# EAGLE design cutdown (EAGLE 9.2.1)
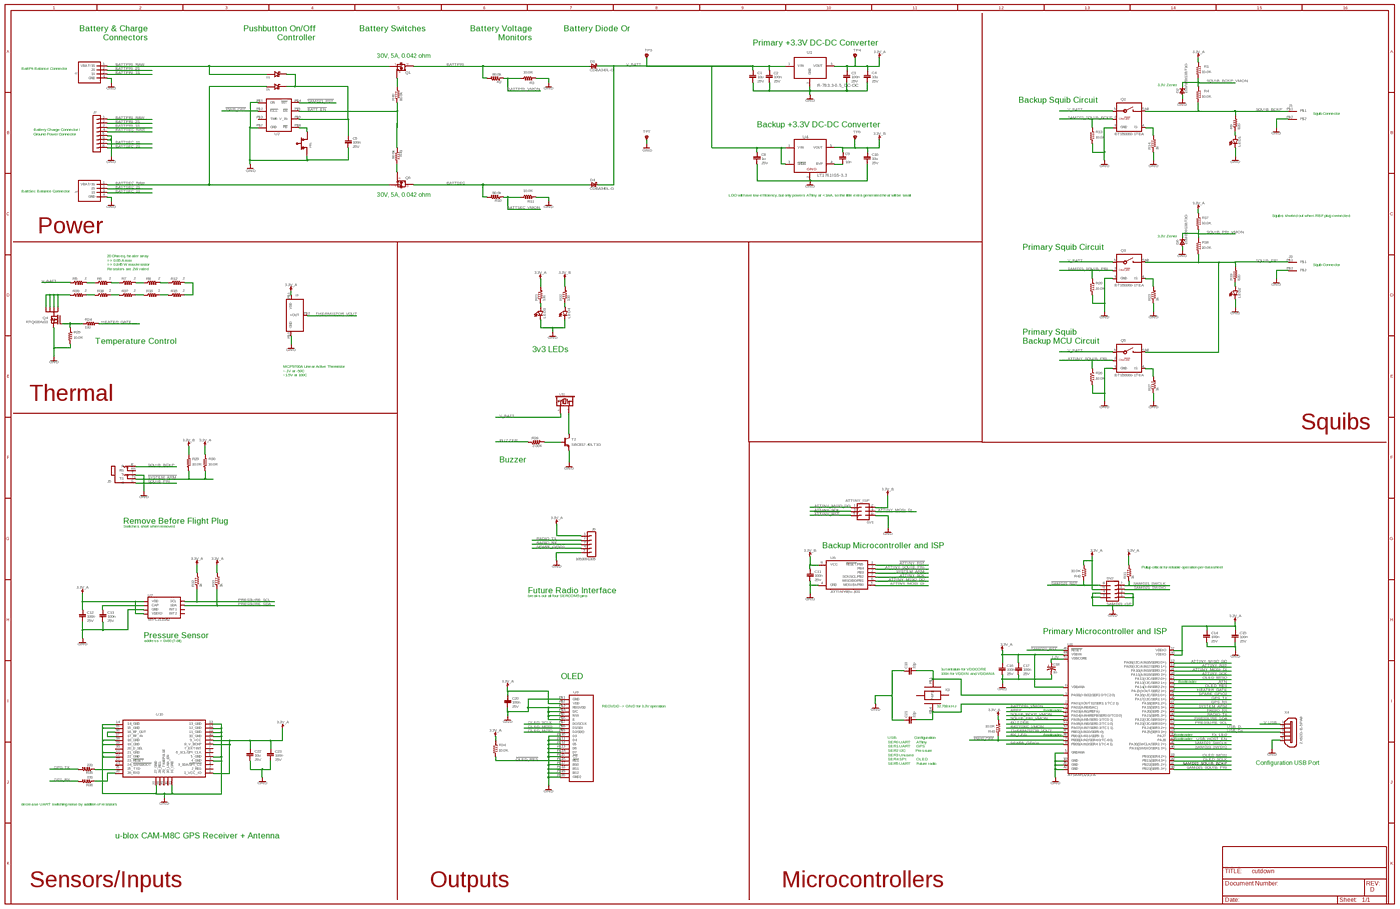
[diagram p0: schematic, sheet 1, overview]
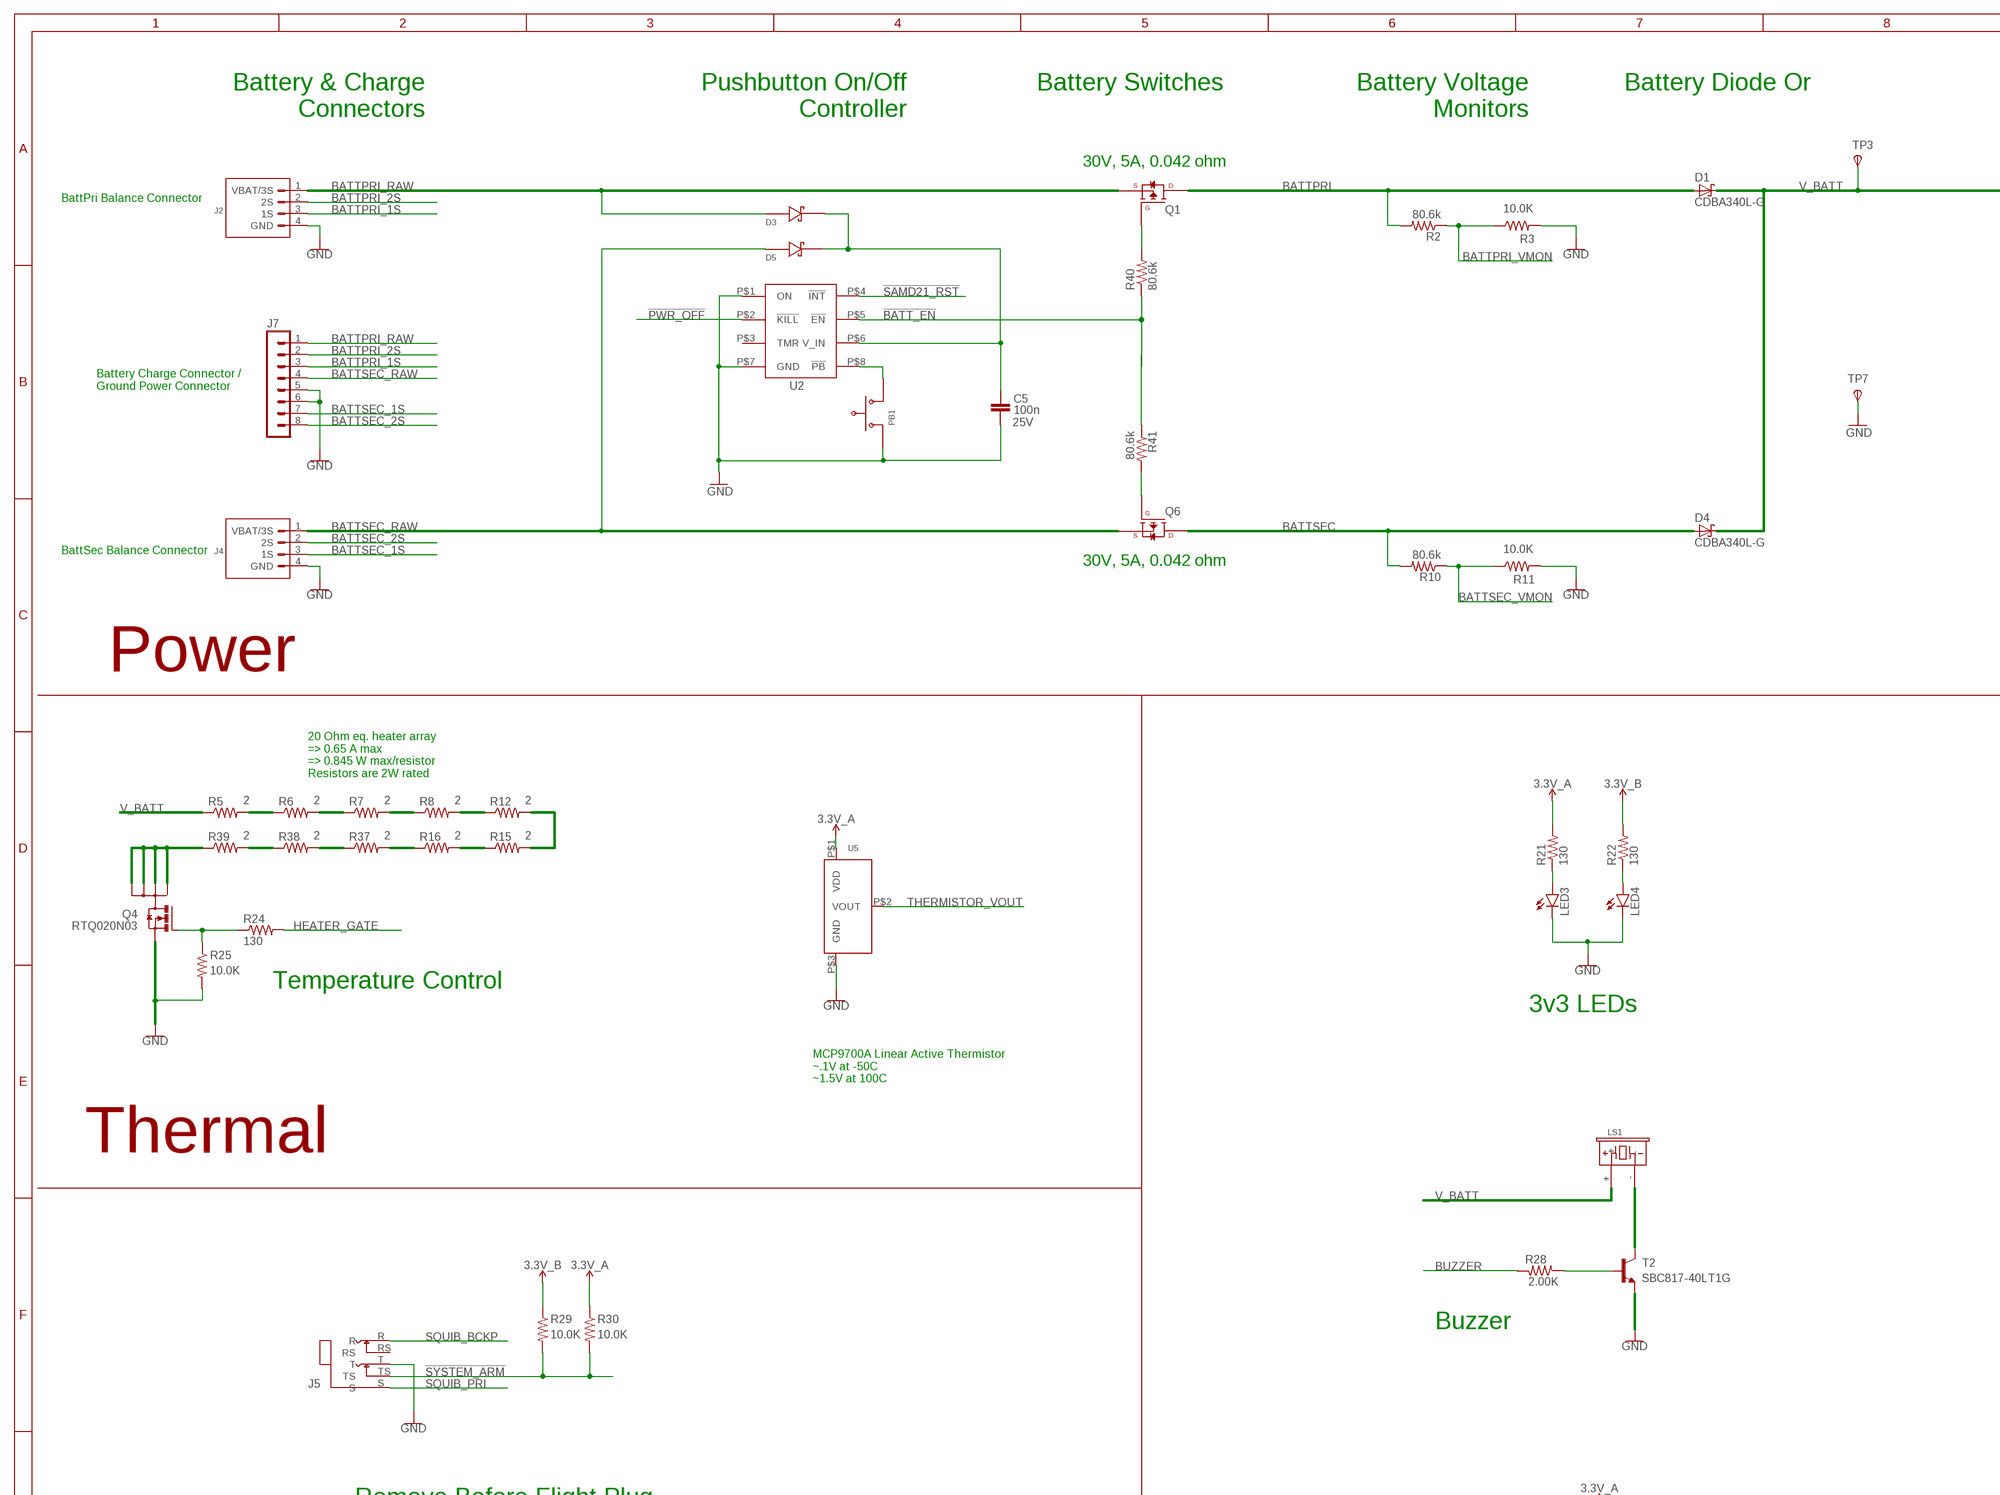
[diagram p1: schematic, sheet 1, part 1 of 4]
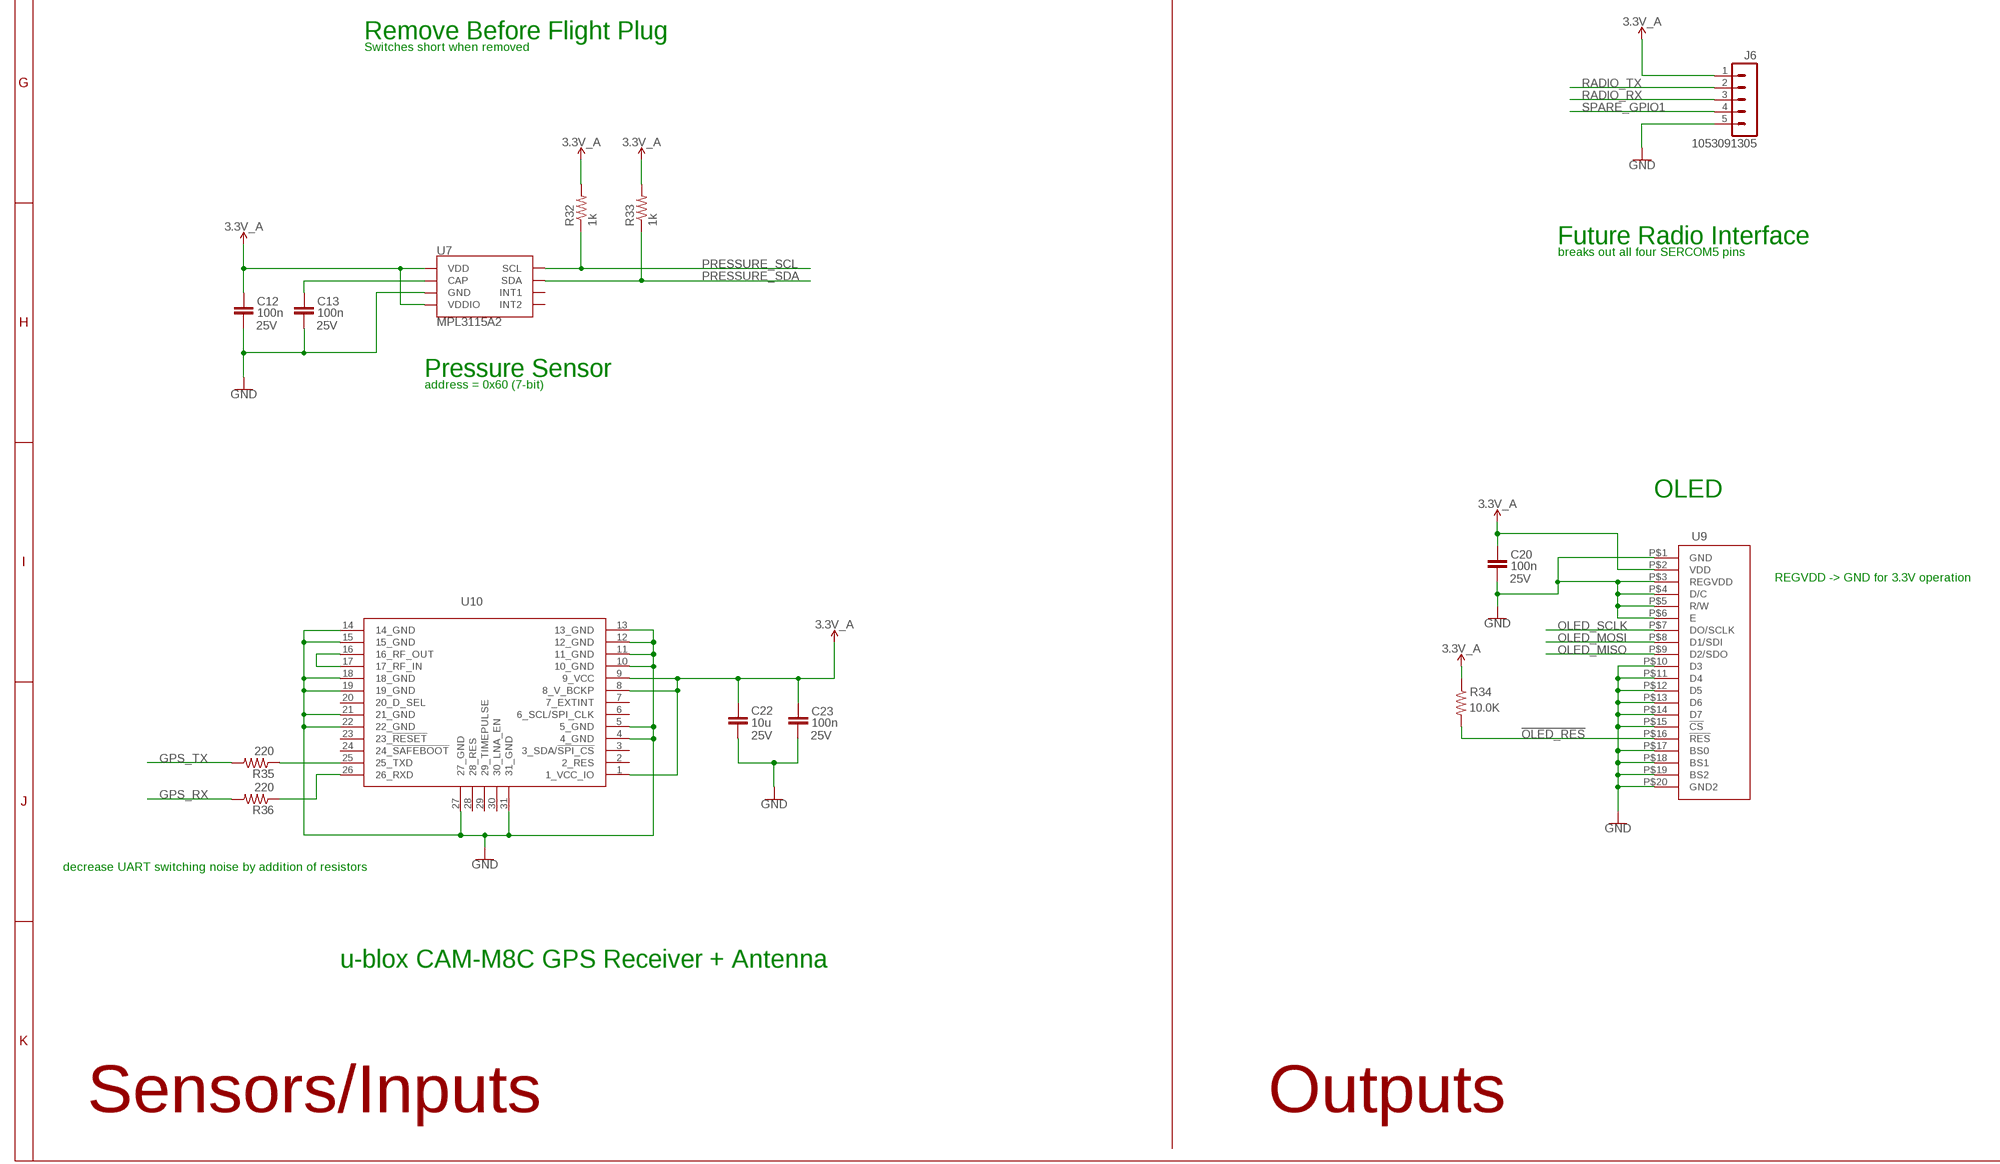
[diagram p2: schematic, sheet 1, part 2 of 4]
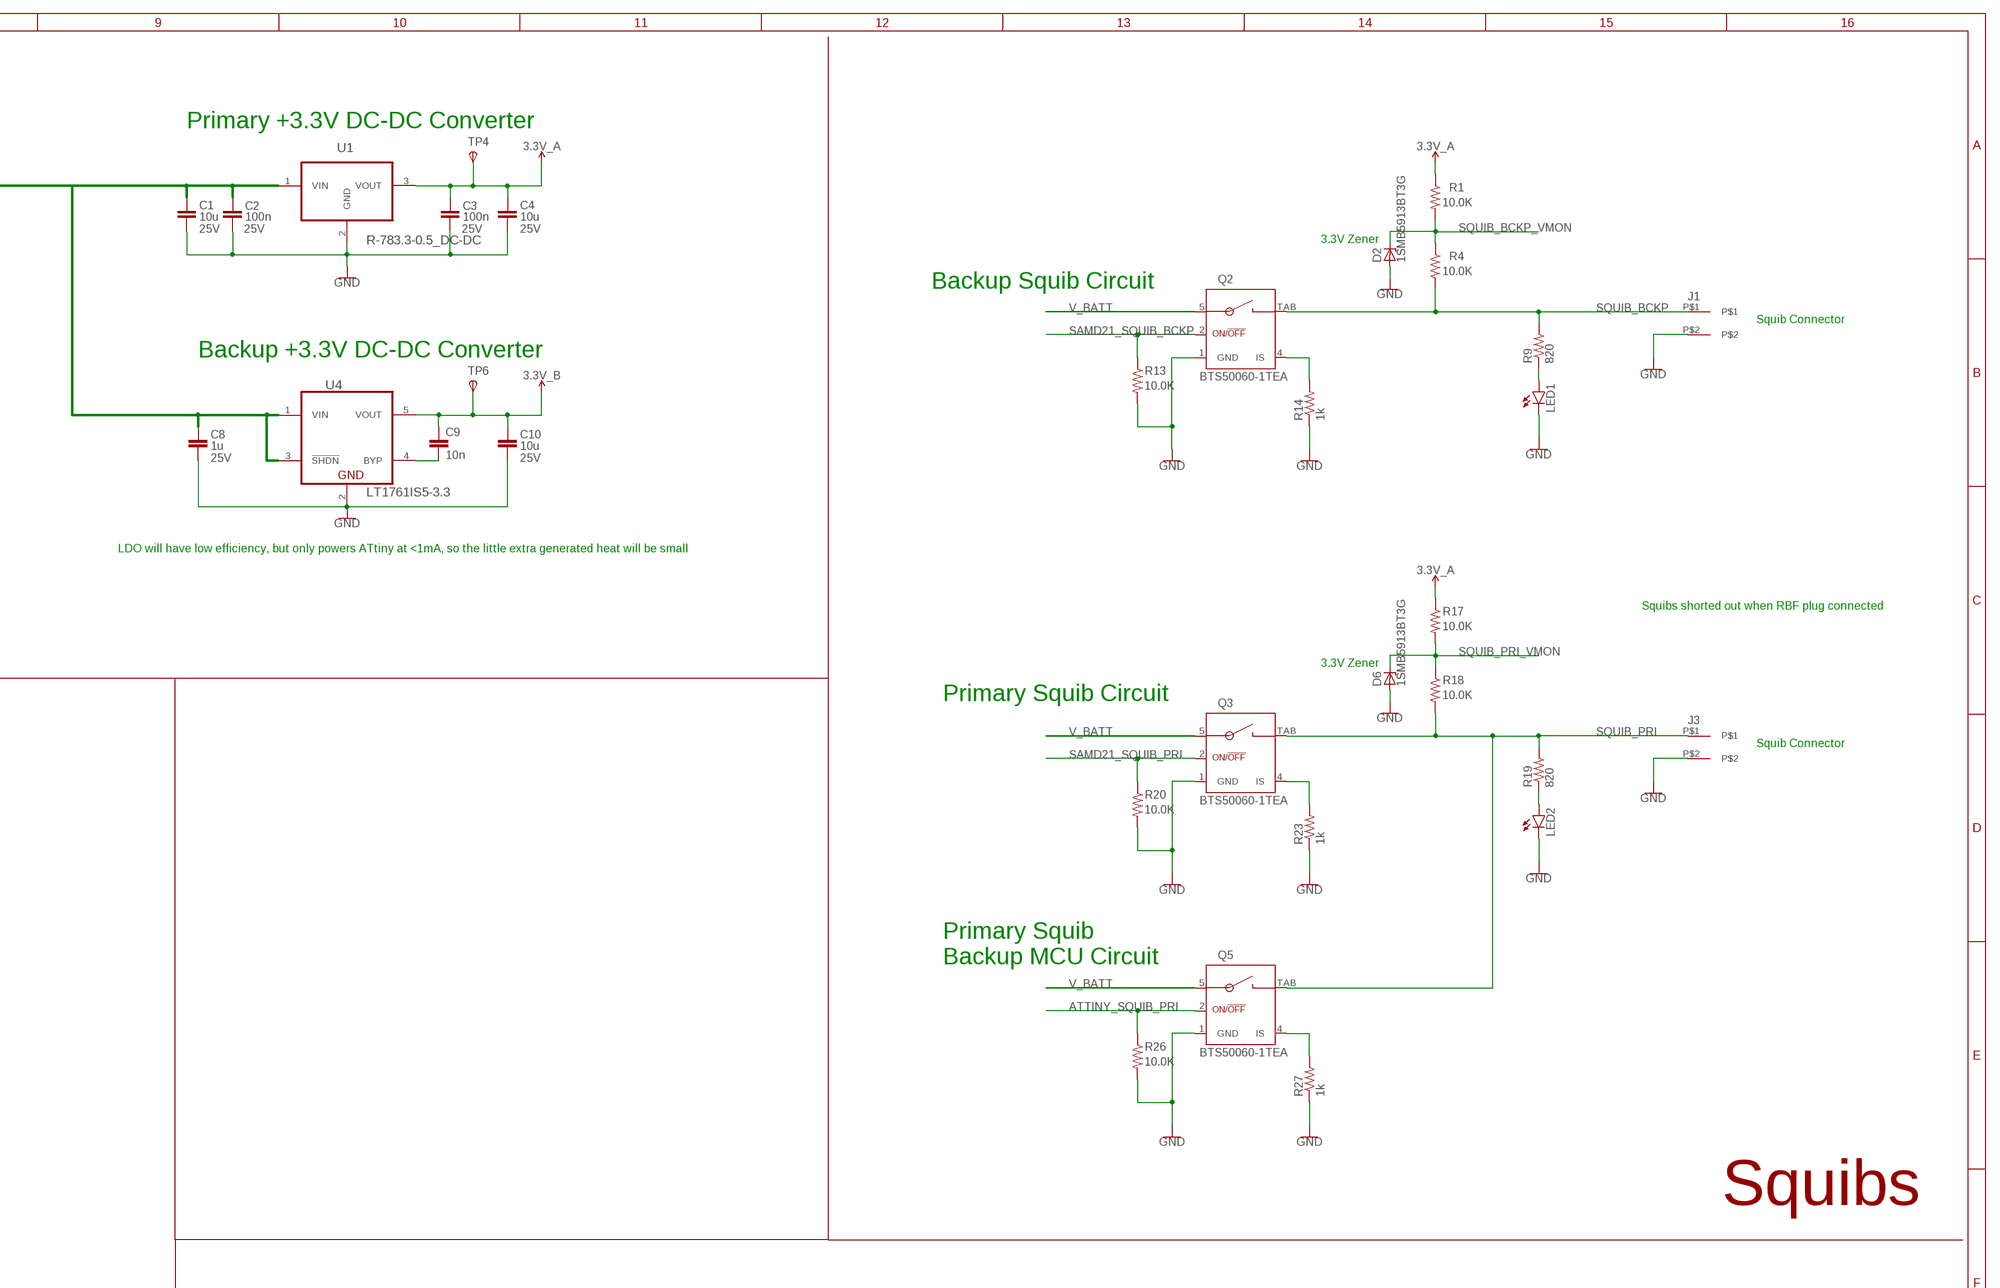
[diagram p3: schematic, sheet 1, part 3 of 4]
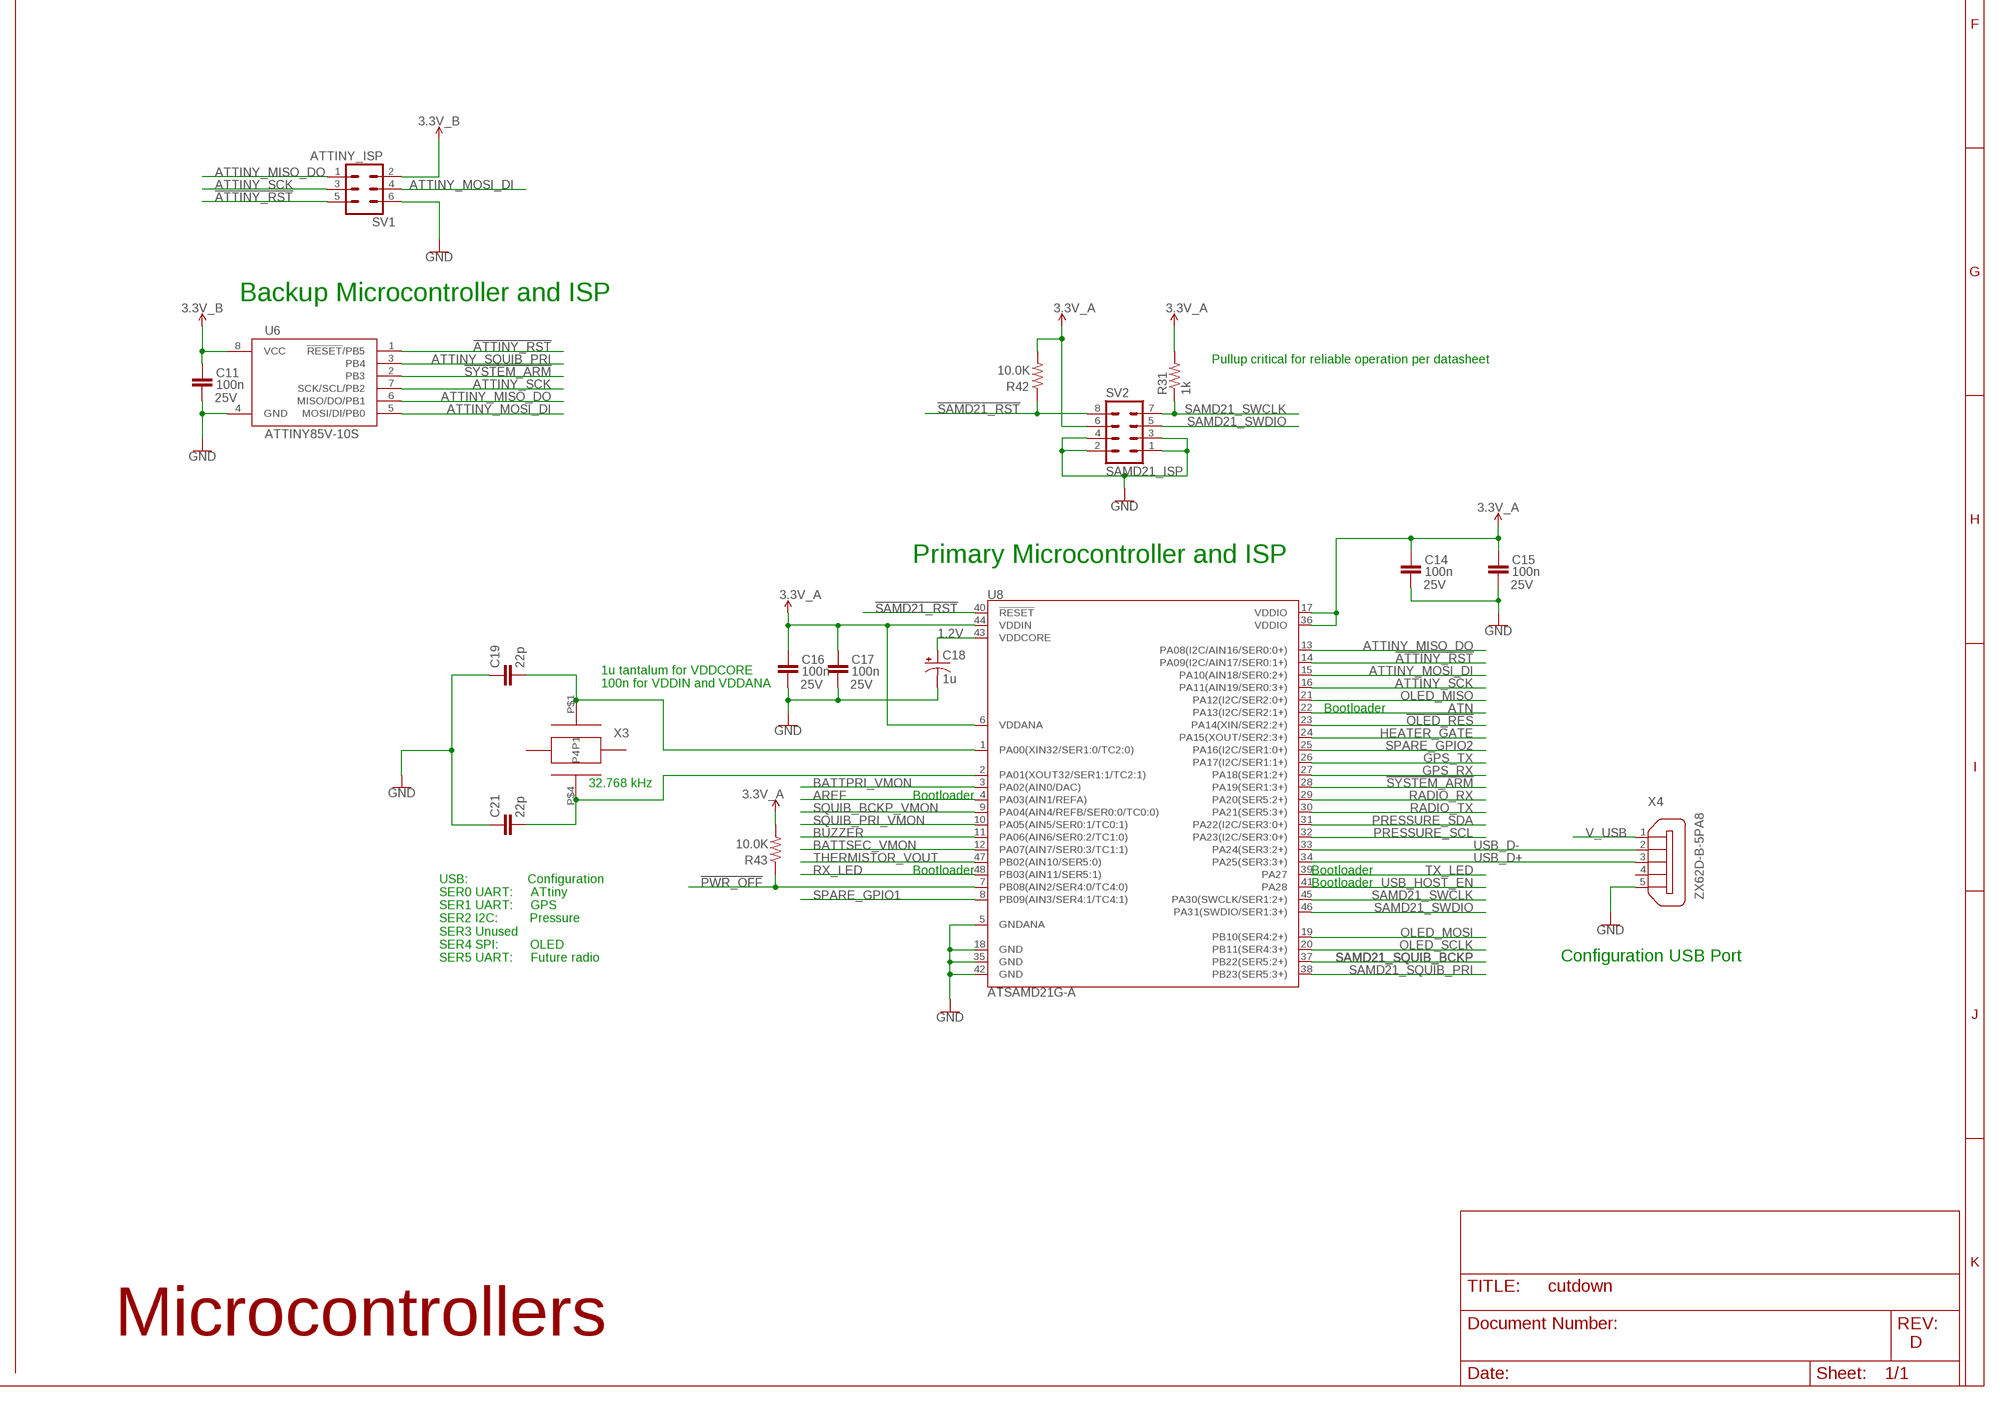
[diagram p4: schematic, sheet 1, part 4 of 4]

## Parts
C1  10u  C-EUC1206  [C1206]
C2  100n  C-EUC0805  [C0805]
C3  100n  C-EUC0805  [C0805]
C4  10u  C-EUC1206  [C1206]
C5  100n  C-EUC0805  [C0805]
C8  1u  C-EUC1206  [C1206]
C9  10n  C-EUC0805  [C0805]
C10  10u  C-EUC1206  [C1206]
C11  100n  C-EUC0805  [C0805]
C12  100n  C-EUC0805  [C0805]
C13  100n  C-EUC0805  [C0805]
C14  100n  C-EUC0805  [C0805]
C15  100n  C-EUC0805  [C0805]
C16  100n  C-EUC0805  [C0805]
C17  100n  C-EUC0805  [C0805]
C18  1u  CPOL-USCT3216  [CT3216]
C19  22p  C-EUC0805  [C0805]
C20  100n  C-EUC0805  [C0805]
C21  22p  C-EUC0805  [C0805]
C22  10u  C-EUC1206  [C1206]
C23  100n  C-EUC0805  [C0805]
D1  CDBA340L-G  [DO214AC]
D2  1SMB5913BT3G  [DO214AA]
D3  BAT54HT1G  [BAT54HT1G]
D4  CDBA340L-G  [DO214AC]
D5  BAT54HT1G  [BAT54HT1G]
D6  1SMB5913BT3G  [DO214AA]
J1  DECTOR_PARTS_TR_NANOFIT_1X2_RA  [DECTOR_PARTS_TR_NANOFIT_1X2_RIGHTANGLE]
J2  S4B-XH-SM4-TB-3S-BALANCE  [S4B-XH-SM4-TB]
J3  DECTOR_PARTS_TR_NANOFIT_1X2_RA  [DECTOR_PARTS_TR_NANOFIT_1X2_RIGHTANGLE]
J4  S4B-XH-SM4-TB-3S-BALANCE  [S4B-XH-SM4-TB]
J5  RN114BPC  [RN114BPC]
J6  1053091305  [1053091305]
J7  1053141208  [1053141208]
LED1  LEDCHIP-LED0805  [CHIP-LED0805]
LED2  LEDCHIP-LED0805  [CHIP-LED0805]
LED3  LEDCHIP-LED0805  [CHIP-LED0805]
LED4  LEDCHIP-LED0805  [CHIP-LED0805]
LS1  CEM-1212C  [CEM-1212C]
PB1  FP11SPA1B1TP03  [FP11SPA1B1TP03]
Q1  SI2347DS-T1-GE3  [SI1247DS]
Q2  BTS50060-1TEA  [PG-TO252-5-11]
Q3  BTS50060-1TEA  [PG-TO252-5-11]
Q4  RTQ020N03  [SC-95(TSMT6)]
Q5  BTS50060-1TEA  [PG-TO252-5-11]
Q6  SI2347DS-T1-GE3  [SI1247DS]
R1  10.0K  R-US_R0805  [R0805]
R2  80.6k  R-US_R0805  [R0805]
R3  10.0K  R-US_R0805  [R0805]
R4  10.0K  R-US_R0805  [R0805]
R5  2  R-US_R2512  [R2512]
R6  2  R-US_R2512  [R2512]
R7  2  R-US_R2512  [R2512]
R8  2  R-US_R2512  [R2512]
R9  820  R-US_R0805  [R0805]
R10  80.6k  R-US_R0805  [R0805]
R11  10.0K  R-US_R0805  [R0805]
R12  2  R-US_R2512  [R2512]
R13  10.0K  R-US_R0805  [R0805]
R14  1k  R-US_R0805  [R0805]
R15  2  R-US_R2512  [R2512]
R16  2  R-US_R2512  [R2512]
R17  10.0K  R-US_R0805  [R0805]
R18  10.0K  R-US_R0805  [R0805]
R19  820  R-US_R0805  [R0805]
R20  10.0K  R-US_R0805  [R0805]
R21  130  R-US_R0805  [R0805]
R22  130  R-US_R0805  [R0805]
R23  1k  R-US_R0805  [R0805]
R24  130  R-US_R0805  [R0805]
R25  10.0K  R-US_R0805  [R0805]
R26  10.0K  R-US_R0805  [R0805]
R27  1k  R-US_R0805  [R0805]
R28  2.00K  R-US_R0805  [R0805]
R29  10.0K  R-US_R0805  [R0805]
R30  10.0K  R-US_R0805  [R0805]
R31  1k  R-US_R0805  [R0805]
R32  1k  R-US_R0805  [R0805]
R33  1k  R-US_R0805  [R0805]
R34  10.0K  R-US_R0805  [R0805]
R35  220  R-US_R0805  [R0805]
R36  220  R-US_R0805  [R0805]
R37  2  R-US_R2512  [R2512]
R38  2  R-US_R2512  [R2512]
R39  2  R-US_R2512  [R2512]
R40  80.6k  R-US_R0805  [R0805]
R41  80.6k  R-US_R0805  [R0805]
R42  10.0K  R-US_R0805  [R0805]
R43  10.0K  R-US_R0805  [R0805]
SV1  ATTINY_ISP  MA03-2  [MA03-2]
SV2  SAMD21_ISP  MA04-2  [MA04-2]
T2  SBC817-40LT1G  BC846  [SOT23]
TP3  TPSPAD1-13  [P1-13]
TP4  TPSPAD1-13  [P1-13]
TP6  TPSPAD1-13  [P1-13]
TP7  TPSPAD1-13  [P1-13]
U1  R-783.3-0.5_DC-DC  [R-783P3-0P5_DC-DC]
U2  LTC2955ITS8-2  [LTC2955_TSOT-8]
U4  LT1761IS5-3.3  [TSOT23-5]
U5  MCP9700T-E/TT  [MCP9700T-E/TT]
U6  ATTINY85V-10S  [SOIC8_EIAJ_208MIL]
U7  MPL3115A2  [LGA-8-5X3]
U8  ATSAMD21G-A  [TQFP-48]
U9  NHD-0216CW-AW3  [NHD-0216CW-AW3]
U10  CAM-M8C-0  [CAM_M8C]
X3  MC-146-32.7680KA-A0  [MC-146]
X4  ZX62D-B-5PA8  [ZX62D-B-5PA8]

## Nets
1.2V: C18.+ U8.43(VDDCORE)
!ATTINY_RST!: SV1.5 U6.1(!RESET!/PB5) U8.14(PA09(I2C/AIN17/SER0:1+))
!BATT_EN: R40.1 R41.1 U2.P$5(!EN)
!OLED_RES!: R34.2 U8.23(PA14(XIN/SER2:2+)) U9.P$16(!RES!)
!PWR_OFF!: R43.1 U2.P$2(!KILL) U8.7(PB08(AIN2/SER4:0/TC4:0))
!SAMD21_RST!: R42.1 SV2.8 U2.P$4(!INT) U8.40(!RESET!)
!SYSTEM_ARM!: J5.TS R29.2 R30.2 U6.2(PB3) U8.28(PA19(SER1:3+))
AREF: U8.4(PA03(AIN1/REFA))
ATN: U8.22(PA13(I2C/SER2:1+))
ATTINY_MISO_DO: SV1.1 U6.6(MISO/DO/PB1) U8.13(PA08(I2C/AIN16/SER0:0+))
ATTINY_MOSI_DI: SV1.4 U6.5(MOSI/DI/PB0) U8.15(PA10(AIN18/SER0:2+))
ATTINY_SCK: SV1.3 U6.7(SCK/SCL/PB2) U8.16(PA11(AIN19/SER0:3+))
ATTINY_SQUIB_PRI: Q5.2(IN) R26.1 U6.3(PB4)
BATTPRI: D1.A Q1.D R2.2
BATTPRI_1S: J2.3(1S) J7.3
BATTPRI_2S: J2.2(2S) J7.2
BATTPRI_RAW: D3.A J2.1(VBAT/3S) J7.1 Q1.S
BATTPRI_VMON: R2.1 R3.1 U8.3(PA02(AIN0/DAC))
BATTSEC: D4.A Q6.D R10.2
BATTSEC_1S: J4.3(1S) J7.7
BATTSEC_2S: J4.2(2S) J7.8
BATTSEC_RAW: D5.A J4.1(VBAT/3S) J7.4 Q6.S
BATTSEC_VMON: R10.1 R11.1 U8.12(PA07(AIN7/SER0:3/TC1:1))
BUZZER: R28.2 U8.11(PA06(AIN6/SER0:2/TC1:0))
GND: C1.2 C2.2 C3.2 C4.2 C5.2 C8.2 C10.2 C11.2 C12.2 C13.2 C14.2 C15.2 C16.2 C17.2 C18.- C19.1 C20.2 C21.1 C22.2 C23.2 D2.A D6.A J1.P$2 J2.4(GND) J3.P$2 J4.4(GND) J5.T J6.5 J7.5 J7.6 LED1.C LED2.C LED3.C LED4.C PB1.1 Q2.1(GND) Q3.1(GND) Q4.4(S) Q5.1(GND) R3.2 R11.2 R13.2 R14.1 R20.2 R23.1 R25.2 R26.2 R27.1 SV1.6 SV2.1 SV2.2 SV2.3 SV2.4 T2.2(E) TP7.TP(PP) U1.2(GND) U2.P$1(ON) U2.P$7(GND) U4.2(GND) U5.P$3(GND) U6.4(GND) U7.3(GND) U8.5(GNDANA) U8.18(GND) U8.35(GND) U8.42(GND) U9.P$1(GND) U9.P$3(REGVDD) U9.P$4(D/C) U9.P$5(R/W) U9.P$6(E) U9.P$10(D3) U9.P$11(D4) U9.P$12(D5) U9.P$13(D6) U9.P$14(D7) U9.P$15(!CS!) U9.P$17(BS0) U9.P$18(BS1) U9.P$19(BS2) U9.P$20(GND2) U10.4(4_GND) U10.5(5_GND) U10.10(10_GND) U10.11(11_GND) U10.12(12_GND) U10.13(13_GND) U10.14(14_GND) U10.15(15_GND) U10.18(18_GND) U10.19(19_GND) U10.21(21_GND) U10.22(22_GND) U10.27(27_GND) U10.31(31_GND) X4.5
GPS_RX: R36.2 U8.27(PA18(SER1:2+))
GPS_TX: R35.2 U8.26(PA17(I2C/SER1:1+))
HEATER_GATE: R24.2 U8.24(PA15(XOUT/SER2:3+))
N$2: R28.1 T2.1(B)
N$3: R5.2 R6.1
N$4: Q1.G R40.2
N$5: R6.2 R7.1
N$6: R7.2 R8.1
N$7: R8.2 R12.1
N$8: R12.2 R15.2
N$9: C13.1 U7.2(CAP)
N$10: U10.16(16_RF_OUT) U10.17(17_RF_IN)
N$11: R35.1 U10.25(25_TXD)
N$12: C21.2 U8.2(PA01(XOUT32/SER1:1/TC2:1)) X3.P$4(P4)
N$13: LED3.A R21.1
N$14: Q2.4(IS) R14.2
N$15: LED4.A R22.1
N$16: LED1.A R9.1
N$17: R15.1 R16.2
N$18: R16.1 R37.2
N$19: Q3.4(IS) R23.2
N$20: Q5.4(IS) R27.2
N$21: LED2.A R19.1
N$22: R37.1 R38.2
N$23: Q4.3(G) R24.1 R25.1
N$24: C19.2 U8.1(PA00(XIN32/SER1:0/TC2:0)) X3.P$1(P1)
N$25: R38.1 R39.2
N$26: LS1.- T2.3(C)
N$27: C9.2 U4.4(BYP)
N$28: R36.1 U10.26(26_RXD)
N$29: Q4.1(D) Q4.2(D) Q4.5(D) Q4.6(D6) R39.1
N$30: Q6.G R41.2
N$32: PB1.3 U2.P$8(!PB)
N$33: C5.1 D3.C D5.C U2.P$6(V_IN)
OLED_MISO: U8.21(PA12(I2C/SER2:0+)) U9.P$9(D2/SDO)
OLED_MOSI: U8.19(PB10(SER4:2+)) U9.P$8(D1/SDI)
OLED_SCLK: U8.20(PB11(SER4:3+)) U9.P$7(DO/SCLK)
PRESSURE_SCL: R32.1 U7.8(SCL) U8.32(PA23(I2C/SER3:0+))
PRESSURE_SDA: R33.1 U7.7(SDA) U8.31(PA22(I2C/SER3:0+))
RADIO_RX: J6.3 U8.29(PA20(SER5:2+))
RADIO_TX: J6.2 U8.30(PA21(SER5:3+))
RX_LED: U8.48(PB03(AIN11/SER5:1))
SAMD21_SQUIB_BCKP: Q2.2(IN) R13.1 U8.37(PB22(SER5:2+))
SAMD21_SQUIB_PRI: Q3.2(IN) R20.1 U8.38(PB23(SER5:3+))
SAMD21_SWCLK: R31.1 SV2.7 U8.45(PA30(SWCLK/SER1:2+))
SAMD21_SWDIO: SV2.5 U8.46(PA31(SWDIO/SER1:3+))
SPARE_GPIO1: J6.4 U8.8(PB09(AIN3/SER4:1/TC4:1))
SPARE_GPIO2: U8.25(PA16(I2C/SER1:0+))
SQUIB_BCKP: J1.P$1 J5.R Q2.TAB(OUT) R4.2 R9.2
SQUIB_BCKP_VMON: D2.C R1.2 R4.1 U8.9(PA04(AIN4/REFB/SER0:0/TC0:0))
SQUIB_PRI: J3.P$1 J5.S Q3.TAB(OUT) Q5.TAB(OUT) R18.2 R19.2
SQUIB_PRI_VMON: D6.C R17.2 R18.1 U8.10(PA05(AIN5/SER0:1/TC0:1))
THERMISTOR_VOUT: U5.P$2(VOUT) U8.47(PB02(AIN10/SER5:0))
TX_LED: U8.39(PA27)
USB_D+: U8.34(PA25(SER3:3+)) X4.3
USB_D-: U8.33(PA24(SER3:2+)) X4.2
USB_HOST_EN: U8.41(PA28)
V_BATT: C1.1 C2.1 C8.1 D1.C D4.C LS1.+ Q2.5(VS) Q3.5(VS) Q5.5(VS) R5.1 TP3.TP(PP) U1.1(VIN) U4.1(VIN) U4.3(!SHDN)
V_USB: X4.1
VCC_1: C3.1 C4.1 C12.1 C14.1 C15.1 C16.1 C17.1 C20.1 C22.1 C23.1 J6.1 R1.1 R17.1 R21.2 R30.1 R31.2 R32.2 R33.2 R34.1 R42.2 R43.2 SV2.6 TP4.TP(PP) U1.3(VOUT) U5.P$1(VDD) U7.1(VDD) U7.4(VDDIO) U8.6(VDDANA) U8.17(VDDIO) U8.36(VDDIO) U8.44(VDDIN) U9.P$2(VDD) U10.1(1_VCC_IO) U10.8(8_V_BCKP) U10.9(9_VCC) ; supply symbol labelled 3.3V_A
VCC_2: C9.1 C10.1 C11.1 R22.2 R29.1 SV1.2 TP6.TP(PP) U4.5(VOUT) U6.8(VCC) ; supply symbol labelled 3.3V_B
Unconnected: J5.RS U2.P$3(TMR) U7.5(INT2) U7.6(INT1) U10.2(2_RES) U10.3(3_SDA/!SPI_CS!) U10.6(6_SCL/SPI_CLK) U10.7(7_EXTINT) U10.20(20_D_SEL) U10.23(23_!RESET!) U10.24(24_!SAFEBOOT!) U10.28(28_RES) U10.29(29_TIMEPULSE) U10.30(30_LNA_EN) X3.P$2 X3.P$3 X4.4 X4.S1 X4.S2 X4.S3 X4.S4

## Notes on the sheet
- Battery & Charge
  Connectors
- Pushbutton On/Off
  Controller
- Battery Switches
- Battery Voltage
  Monitors
- Battery Diode Or
- Primary +3.3V DC-DC Converter
- 30V, 5A, 0.042 ohm
- BattPri Balance Connector
- 3.3V Zener
- Backup Squib Circuit
- Squib Connector
- Backup +3.3V DC-DC Converter
- Battery Charge Connector /
  Ground Power Connector
- BattSec Balance Connector
- 30V, 5A, 0.042 ohm | LDO will have low efficiency, but only powers ATtiny at <1mA, so the little extra generated heat will be small
- Squibs shorted out when RBF plug connected
- Power
- 3.3V Zener
- Primary Squib Circuit
- Squib Connector
- 20 Ohm eq. heater array
  => 0.65 A max
  => 0.845 W max/resistor
  Resistors are 2W rated
- Temperature Control
- Primary Squib
  Backup MCU Circuit
- 3v3 LEDs
- MCP9700A Linear Active Thermistor
  ~.1V at -50C
  ~1.5V at 100C
- Thermal
- Squibs
- Buzzer
- Remove Before Flight Plug
- Switches short when removed
- Backup Microcontroller and ISP
- Pullup critical for reliable operation per datasheet
- Future Radio Interface
- breaks out all four SERCOM5 pins
- Primary Microcontroller and ISP
- Pressure Sensor
- address = 0x60 (7-bit)
- 1u tantalum for VDDCORE
  100n for VDDIN and VDDANA
- OLED
- Bootloader
- REGVDD -> GND for 3.3V operation | 32.768 kHz
- Bootloader
- Bootloader | Bootloader
- Bootloader
- USB:                 Configuration
  SER0 UART:     ATtiny
  SER1 UART:     GPS
  SER2 I2C:         Pressure
  SER3 Unused
  SER4 SPI:         OLED
  SER5 UART:     Future radio
- Configuration USB Port
- decrease UART switching noise by addition of resistors
- u-blox CAM-M8C GPS Receiver + Antenna
- Sensors/Inputs | Outputs | Microcontrollers
- D

## Library data of the parts
C1 C4 C10 C22 = rcl:C-EU: CAPACITOR, European symbol; MFG: Samsung; MFG_DESCRIPTION: CAP CER 10UF 25V X7R 1206; MFG_PN: CL31B106KAHZW6E; VOLTAGE: 25V
C2 C3 C5 C11-C17 C20 C23 = resistor:C-EU: CAPACITOR, European symbol; MFG: AVX; MFG_DESCRIPTION: 0.10µF ±10% 25V Ceramic Capacitor X7R 0805; MFG_PN: 08053C104KAT2A; VOLTAGE: 25V
C8 = rcl:C-EU: CAPACITOR, European symbol; MFG: KEMET; MFG_DESCRIPTION: CAP CER 1UF 25V X7R 1206; MFG_PN: C1206C105K3RACTU; VOLTAGE: 25V
C9 = rcl:C-EU: CAPACITOR, European symbol; MFG: Kemet; MFG_DESCRIPTION: CAP CER 10000PF 50V X7R 0805; MFG_PN: C0805C103K5RACTU; SPICEPREFIX: C
C18 = rcl:CPOL-US: POLARIZED CAPACITOR, American symbol; MFG: Kemet; MFG_DESCRIPTION: CAP TANT 1UF 10% 16V 1206; MFG_PN: T491A105K016AT; SPICEPREFIX: C
C19 C21 = rcl:C-EU: CAPACITOR, European symbol; MFG: Kemet; MFG_DESCRIPTION: CAP CER 22PF 50V C0G/NP0 0805; MFG_PN: C0805C220K5GACTU; SPICEPREFIX: C
D1 D4 = Dector_Parts_TR:CDBA340L-G: Diode Schottky 40V 3A Surface Mount DO-214AC; MFG: COMCHIP; MFG_DESCRIPTION: Diode Schottky 40V 3A Surface Mount DO-214AC; MFG_PN: CDBA340L-G
D2 D6 = 1smb59xx_10:1SMB59*BT3G: 1SMB59xxBT3G Series 3 Watt Plastic Surface Mount Zener Voltage Regulators Source: http://www.onsemi.com/pub_link/Collateral/1SMB5913BT3-D.PDF; MF: ON Semiconductor; MFG: ON Semiconductor; MFG_DESCRIPTION: DIODE ZENER 3.3V 3W SMB; MFG_PN: 1SMB5913BT3G; MPN: 1SMB5913BT3G; OC_FARNELL: 1431155; OC_NEWARK: 88H5165
D3 D5 = Dector_Parts_TR:BAT54HT1G; MFG: ON Semiconductor; MFG_DESCRIPTION: DIODE SCHOTTKY 30V 200MA SOD323; MFG_PN: BAT54HT1G
J1 J3 = Solar Cell Carrier Board:DECTOR_PARTS_TR_NANOFIT_1X2_RA: https://www.molex.com/pdm_docs/sd/1053131102_sd.pdf; MFG: Molex; MFG_DESCRIPTION: NANO-FIT RIGHT ANGLE HEADER, TH; MFG_PN: 1053131102
J2 J4 = Dector_Parts_TR:S4B-XH-SM4-TB-3S-BALANCE; MFG: JST Sales America Inc.; MFG_DESCRIPTION: CONN HEADER SMD R/A 4POS 2.5MM; MFG_PN: S4B-XH-SM4-TB(LF)(SN)
J5 = Dector_Parts_TR:RN114BPC; MFG: Switchcraft Inc.; MFG_DESCRIPTION: CONN JACK STEREO 6.35MM R/A; MFG_PN: RN114BPC
J6 = Dector_Parts_TR:1053091305: 5 Pin, 1 Row, Vert PCB; MFG: MOLEX; MFG_DESCRIPTION: NANO-FIT HDR VT SGL KNK 5CKT 30A; MFG_PN: 1053091305
J7 = Dector_Parts_TR:1053141208; MFG: Molex; MFG_DESCRIPTION: CONN HEADER R/A 8POS 2.5MM; MFG_PN: 1053141208
LED1 LED2 = led:LED: LED OSRAM: - CHIPLED LG R971, LG N971, LY N971, LG Q971, LY Q971, LO R971, LY R971 LH N974, LH R974 LS Q976, LO Q976, LY Q976 LO Q996 - Hyper CHIPLED LW Q18S LB Q993, LB Q99A, LB R99A - SideLED LS A670, LO A670, LY A670, LG A670, LP A670 LB A673, LV A673, LT A673, LW A673 LH A674 LY A675 LS A676, LA A676, LO A676, LY A676, LW A676 LS A679, LY A679, LG A679 - Hyper Micro SIDELED® LS Y876, LA Y876, LO Y876, LY Y876 LT Y87S - SmartLED LW L88C, LW L88S LB L89C, LB L89S, LG L890 LS L89K, LO L89K, LY L89K LS L896, LA L896, LO L896, LY L896 - TOPLED LS T670, LO T670, LY T670, LG T670, LP T670 LSG T670, LSP T670, LSY T670, LOP T670, LYG T670 LG T671, LOG T671, LSG T671 LB T673, LV T673, LT T673, LW T673 LH T674 LS T676, LA T676, LO T676, LY T676, LB T676, LH T676, LSB T676, LW T676 LB T67C, LV T67C, LT T67C, LS T67K, LO T67K, LY T67K, LW E67C LS E67B, LA E67B, LO E67B, LY E67B, LB E67C, LV E67C, LT E67C LW T67C LS T679, LY T679, LG T679 LS T770, LO T770, LY T770, LG T770, LP T770 LB T773, LV T773, LT T773, LW T773 LH T774 LS E675, LA E675, LY E675, LS T675 LS T776, LA T776, LO T776, LY T776, LB T776 LHGB T686 LT T68C, LB T68C - Hyper Mini TOPLED® LB M676 - Mini TOPLED Santana® LG M470 LS M47K, LO M47K, LY M47K Source: http://www.osram.convergy.de LUXEON: - LUMILED® LXK2-PW12-R00, LXK2-PW12-S00, LXK2-PW14-U00, LXK2-PW14-V00 LXK2-PM12-R00, LXK2-PM12-S00, LXK2-PM14-U00 LXK2-PE12-Q00, LXK2-PE12-R00, LXK2-PE12-S00, LXK2-PE14-T00, LXK2-PE14-U00 LXK2-PB12-K00, LXK2-PB12-L00, LXK2-PB12-M00, LXK2-PB14-N00, LXK2-PB14-P00, LXK2-PB14-Q00 LXK2-PR12-L00, LXK2-PR12-M00, LXK2-PR14-Q00, LXK2-PR14-R00 LXK2-PD12-Q00, LXK2-PD12-R00, LXK2-PD12-S00 LXK2-PH12-R00, LXK2-PH12-S00 LXK2-PL12-P00, LXK2-PL12-Q00, LXK2-PL12-R00 Source: www.luxeon.com KINGBRIGHT: KA-3528ASYC Source: www.kingbright.com; MFG: Lite-On; MFG_DESCRIPTION: LED RED CLEAR SMD; MFG_PN: LTST-C171KRKT
LED3 LED4 = led:LED: LED OSRAM: - CHIPLED LG R971, LG N971, LY N971, LG Q971, LY Q971, LO R971, LY R971 LH N974, LH R974 LS Q976, LO Q976, LY Q976 LO Q996 - Hyper CHIPLED LW Q18S LB Q993, LB Q99A, LB R99A - SideLED LS A670, LO A670, LY A670, LG A670, LP A670 LB A673, LV A673, LT A673, LW A673 LH A674 LY A675 LS A676, LA A676, LO A676, LY A676, LW A676 LS A679, LY A679, LG A679 - Hyper Micro SIDELED® LS Y876, LA Y876, LO Y876, LY Y876 LT Y87S - SmartLED LW L88C, LW L88S LB L89C, LB L89S, LG L890 LS L89K, LO L89K, LY L89K LS L896, LA L896, LO L896, LY L896 - TOPLED LS T670, LO T670, LY T670, LG T670, LP T670 LSG T670, LSP T670, LSY T670, LOP T670, LYG T670 LG T671, LOG T671, LSG T671 LB T673, LV T673, LT T673, LW T673 LH T674 LS T676, LA T676, LO T676, LY T676, LB T676, LH T676, LSB T676, LW T676 LB T67C, LV T67C, LT T67C, LS T67K, LO T67K, LY T67K, LW E67C LS E67B, LA E67B, LO E67B, LY E67B, LB E67C, LV E67C, LT E67C LW T67C LS T679, LY T679, LG T679 LS T770, LO T770, LY T770, LG T770, LP T770 LB T773, LV T773, LT T773, LW T773 LH T774 LS E675, LA E675, LY E675, LS T675 LS T776, LA T776, LO T776, LY T776, LB T776 LHGB T686 LT T68C, LB T68C - Hyper Mini TOPLED® LB M676 - Mini TOPLED Santana® LG M470 LS M47K, LO M47K, LY M47K Source: http://www.osram.convergy.de LUXEON: - LUMILED® LXK2-PW12-R00, LXK2-PW12-S00, LXK2-PW14-U00, LXK2-PW14-V00 LXK2-PM12-R00, LXK2-PM12-S00, LXK2-PM14-U00 LXK2-PE12-Q00, LXK2-PE12-R00, LXK2-PE12-S00, LXK2-PE14-T00, LXK2-PE14-U00 LXK2-PB12-K00, LXK2-PB12-L00, LXK2-PB12-M00, LXK2-PB14-N00, LXK2-PB14-P00, LXK2-PB14-Q00 LXK2-PR12-L00, LXK2-PR12-M00, LXK2-PR14-Q00, LXK2-PR14-R00 LXK2-PD12-Q00, LXK2-PD12-R00, LXK2-PD12-S00 LXK2-PH12-R00, LXK2-PH12-S00 LXK2-PL12-P00, LXK2-PL12-Q00, LXK2-PL12-R00 Source: www.luxeon.com KINGBRIGHT: KA-3528ASYC Source: www.kingbright.com; MFG: Lite-On; MFG_DESCRIPTION: LED GREEN CLEAR CHIP SMD; MFG_PN: LTST-C171GKT
LS1 = Dector_Parts_TR:CEM-1212C; MFG: CUI Devices; MFG_DESCRIPTION: AUDIO MAGNETIC IND 8-16V TH; MFG_PN: CEM-1212C
PB1 = Dector_Parts_TR:FP11SPA1B1TP03; MFG: C&G; MFG_DESCRIPTION: SWITCH PUSH SPST-NO 0.4VA 28V; MFG_PN: FP11SPA1B1TP03
Q1 Q6 = Dector_Parts_TR:SI2347DS-T1-GE3; MFG: Vishay Siliconix; MFG_DESCRIPTION: MOSFET P-CH 30V 5A SOT-23; MFG_PN: SI2347DS-T1-GE3
Q2 Q3 Q5 = Dector_Parts_TR:BTS50060-1TEA: BTS50060-1TEA 6m ohm High Side Switch D2-Pak (TO-252, 4 pins plus tab); MFG: Infineon; MFG_DESCRIPTION: PWR SW HI-SIDE 1CH TO252-5; MFG_PN: BTS500601TEAAUMA2
Q4 = Dector_Parts_TR:RTQ020N03: MOSFET N-CH 30V 2A TSMT6; MFG: Rohm; MFG_DESCRIPTION: MOSFET N-CH 30V 2A TSMT6; MFG_PN: RTQ020N03TR
R1 R3 R4 R11 R13 R17 R18 R20 R25 R26 R29 R30 R34 R42 R43 = resistor:R-US_: RESISTOR, American symbol; MFG: Panasonic; MFG_DESCRIPTION: RES SMD 10.0K OHM 1% 1/8W 0805; MFG_PN: ERJ-6ENF1002V; PWR: 0.125
R2 R10 R40 R41 = rcl:R-US_: RESISTOR, American symbol; MFG: Panasonic; MFG_DESCRIPTION: RES SMD 80.6K OHM 1% 1/8W 0805; MFG_PN: ERJ-6ENF8062V; PWR: 0.125; SPICEPREFIX: R
R5-R8 R12 R15 R16 R37-R39 = resistor:R-US_: RESISTOR, American symbol; MFG: Bourns Inc.; MFG_DESCRIPTION: RES SMD 2 OHM 5% 2W 2512; MFG_PN: CRM2512-JW-2R0ELF; PWR: 2
R9 R19 = rcl:R-US_: RESISTOR, American symbol; MFG: Panasonic; MFG_DESCRIPTION: RES SMD 820 OHM 1% 1/8W 0805; MFG_PN: ERJ-6ENF8200V; PWR: 0.125; SPICEPREFIX: R
R14 R23 R27 R31-R33 = rcl:R-US_: RESISTOR, American symbol; MFG: Panasonic; MFG_DESCRIPTION: RES SMD 1K OHM 1% 1/8W 0805; MFG_PN: ERJ-6ENF1001V; PWR: 0.125; SPICEPREFIX: R
R21 R22 R24 = rcl:R-US_: RESISTOR, American symbol; MFG: Panasonic; MFG_DESCRIPTION: RES SMD 130 OHM 1% 1/8W 0805; MFG_PN: ERJ-6ENF1300V; PWR: 0.125; SPICEPREFIX: R
R28 = resistor:R-US_: RESISTOR, American symbol; MFG: Panasonic; MFG_DESCRIPTION: RES SMD 2.00K OHM 1% 1/8W 0805; MFG_PN: ERJ-6ENF2001V; PWR: 0.125
R35 R36 = rcl:R-US_: RESISTOR, American symbol; MFG: Panasonic; MFG_DESCRIPTION: RES SMD 220 OHM 1% 1/8W 0805; MFG_PN: ERJ-6ENF2200V; PWR: 0.125; SPICEPREFIX: R
SV1 = con-lstb:MA03-2: PIN HEADER; MFG: Amphenol; MFG_DESCRIPTION: CONN HEADER 6POS .100 STR TIN; MFG_PN: 67996-406HLF; OC_FARNELL: unknown; OC_NEWARK: unknown
SV2 = con-lstb:MA04-2: PIN HEADER; MFG: Amphenol; MFG_DESCRIPTION: CONN HEADER 8POS .100 STR TIN; MFG_PN: 67996-408HLF; OC_FARNELL: unknown; OC_NEWARK: unknown
T2 = transistor-neu-to92:BC846: NPN TRANSISTOR; MFG: On Semi; MFG_DESCRIPTION: TRANS NPN 45V 0.5A SOT-23; MFG_PN: SBC817-40LT1G
TP3 TP4 TP6 = testpad:TPS: TEST PIN
TP7 = testpad:TPS: TEST PIN; MFG: Keystone; MFG_DESCRIPTION: Black PC Test Point, Miniature 0.100 Dia x 0.180 L; MFG_PN: 5001
U1 = Dector_Parts_TR:R-783.3-0.5_DC-DC: RECOM P/N: R-783.3-0.5, DC DC Converter 1 Output 3.3V 500mA 4.75V - 32V Input; MFG: RECOM; MFG_DESCRIPTION: DC DC CONVERTER 3.3V 3W; MFG_PN: R-783.3-0.5
U2 = Dector_Parts_TR:LTC2955ITS8-2; MFG: Linear Technology/Analog Devices; MFG_DESCRIPTION: IC CTLR ON/OFF PUSHBUTT TSOT23-8; MFG_PN: LTC2955ITS8-2#TRMPBF
U4 = Dector_Parts_TR:LT1761IS5-3.3: Linear Voltage Regulator IC Positive Fixed 1 Output 3.3V 100mA TSOT-23-5; MFG: Linear Technology; MFG_DESCRIPTION: IC REG LIN 3.3V 100MA TSOT23-5; MFG_PN: LT1761IS5-3.3#TRMPBF
U5 = Dector_Parts_TR:MCP9700T-E/TT; MFG: Microchip Technology; MFG_DESCRIPTION: SENSOR ANALOG -40C-125C SOT23-3; MFG_PN: MCP9700T-E/TT
U6 = _hhn_attiny25_45_85:ATTINY85*: ATMEL ATtiny 85 Packages: P = PDIP 08 30mil S = SOIC 08 EIAJ 208mil Technologies Note: for complete ordering code (temp. range, finish, tape&reel etc.) see www.atmel.com • Supply Voltage: V = (1.8…5.5)V | [blank] = (2.7…5.5)V • Speed: 10 = 10 MHz | 20 = 20 MHz Author: Dipl.-Ing. FH Rainer Bayer HHN Hochschule Heilbronn (Heilbronn University), rainer.bayer@hs-heilbronn.de Ingenieurbüro ing-rb, mail@ing-rb.de; MFG: Atmel; MFG_DESCRIPTION: IC MCU 8BIT 8KB FLASH 8SOIC; MFG_PN: ATTINY85V-10SU
U7 = SparkFun-Sensors:MPL3115A2: NXP MPL3115A2 Digital Altimeter/Pressure Sensor The MPL3115A2 is a compact piezoresistive absolute pressure sensor with an I2C interface. MPL3115 has a wide operating range of 20kPa to 110 kPa, a range that covers all surface elevations on Earth. The fully internally compensated MEMS in conjunction with an embedded high resolution 24-bit equivalent ADC provide accurate pressure [Pascals] /altitude [meters] and temperature [degrees Celsius] data. Datasheet <http://cdn.sparkfun.com/datasheets/Sensors/Pressure/MPL3115A2.pdf> SparkFun Products SparkFun Altitude/Pressure Sensor Breakout - MPL3115A2 <https://www.sparkfun.com/products/11084> (SEN-11084) SparkFun Weather Shield <https://www.sparkfun.com/products/12081> (DEV-12081) SparkFun Photon Weather Shield <https://www.sparkfun.com/products/13630> (DEV-13630); MFG: NXP; MFG_DESCRIPTION: IC ALTIMETER I2C VERSION 8LGA; MFG_PN: MPL3115A2; PROD_ID: IC-10869
U8 = samd21_lib:ATSAMD21G: Atmel SAMD21G SMART ARM-Based Microcontroller The Atmel ® | SMART ™ SAM D21 is a series of low-power microcontrollers using the 32-bit ARM ® Cortex ® -M0+ processor, and ranging from 32- to 64-pins with up to 256KB Flash and 32KB of SRAM. The SAM D21 devices operate at a maximum frequency of 48MHz and reach 2.46 CoreMark/MHz. They are designed for simple and intuitive migration with identical peripheral modules, hex compatible code, identical linear address map and pin compatible migration paths between all devices in the product series. All devices include intelligent and flexible peripherals, Atmel Event System for inter-peripheral signaling, and support for capacitive touch button, slider and wheel user interfaces.; MFG: Atmel; MFG_DESCRIPTION: IC MCU 32BIT 256KB FLASH 48TQFP; MFG_PN: ATSAMD21G18A-AUT; PROD_ID: IC-13064
U9 = Dector_Parts_TR:NHD-0216CW-AW3: 2x16 Character LCD Display Module 5 x 8 Dots OLED Parallel, 8-Bit, I²C, SPI 76.00mm x 24.50mm x 5.00mm; MFG: Newhaven; MFG_DESCRIPTION: 2X16 WHITE SLIM CHARACTER OLED; MFG_PN: NHD-0216CW-AW3
U10 = Dector_Parts_TR:CAM-M8C-0; MFG: U-Blox America Inc.; MFG_DESCRIPTION: RF RCVR GNSS/GPS 1.575GHZ MODULE; MFG_PN: CAM-M8C-0
X3 = Dector_Parts_TR:MC-146-32.7680KA-A0: CRYSTAL 32.7680 KHZ 12.5PF SMD; MFG: Epson; MFG_DESCRIPTION: CRYSTAL 32.7680 KHZ 12.5PF SMD; MFG_PN: MC-146 32.7680KA-A0:ROHS
X4 = zx62d-b-5pa8-oshpark_10:ZX62D-B-5PA8: Micro USB Type B Connector - Standard, Shell Through Hole Source: http://www.hirose.co.jp/cataloge_hp/ed_ZX_20140804.pdf; MF: Hirose; MFG: Hirose; MFG_DESCRIPTION: CONN RCPT USB MICRO B 2.0 5P SMD; MFG_PN: ZX62D-B-5PA8(30); MPN: ZX62D-B-5PA8; OC_FARNELL: 2300438; OC_NEWARK: 69W0712

## Board
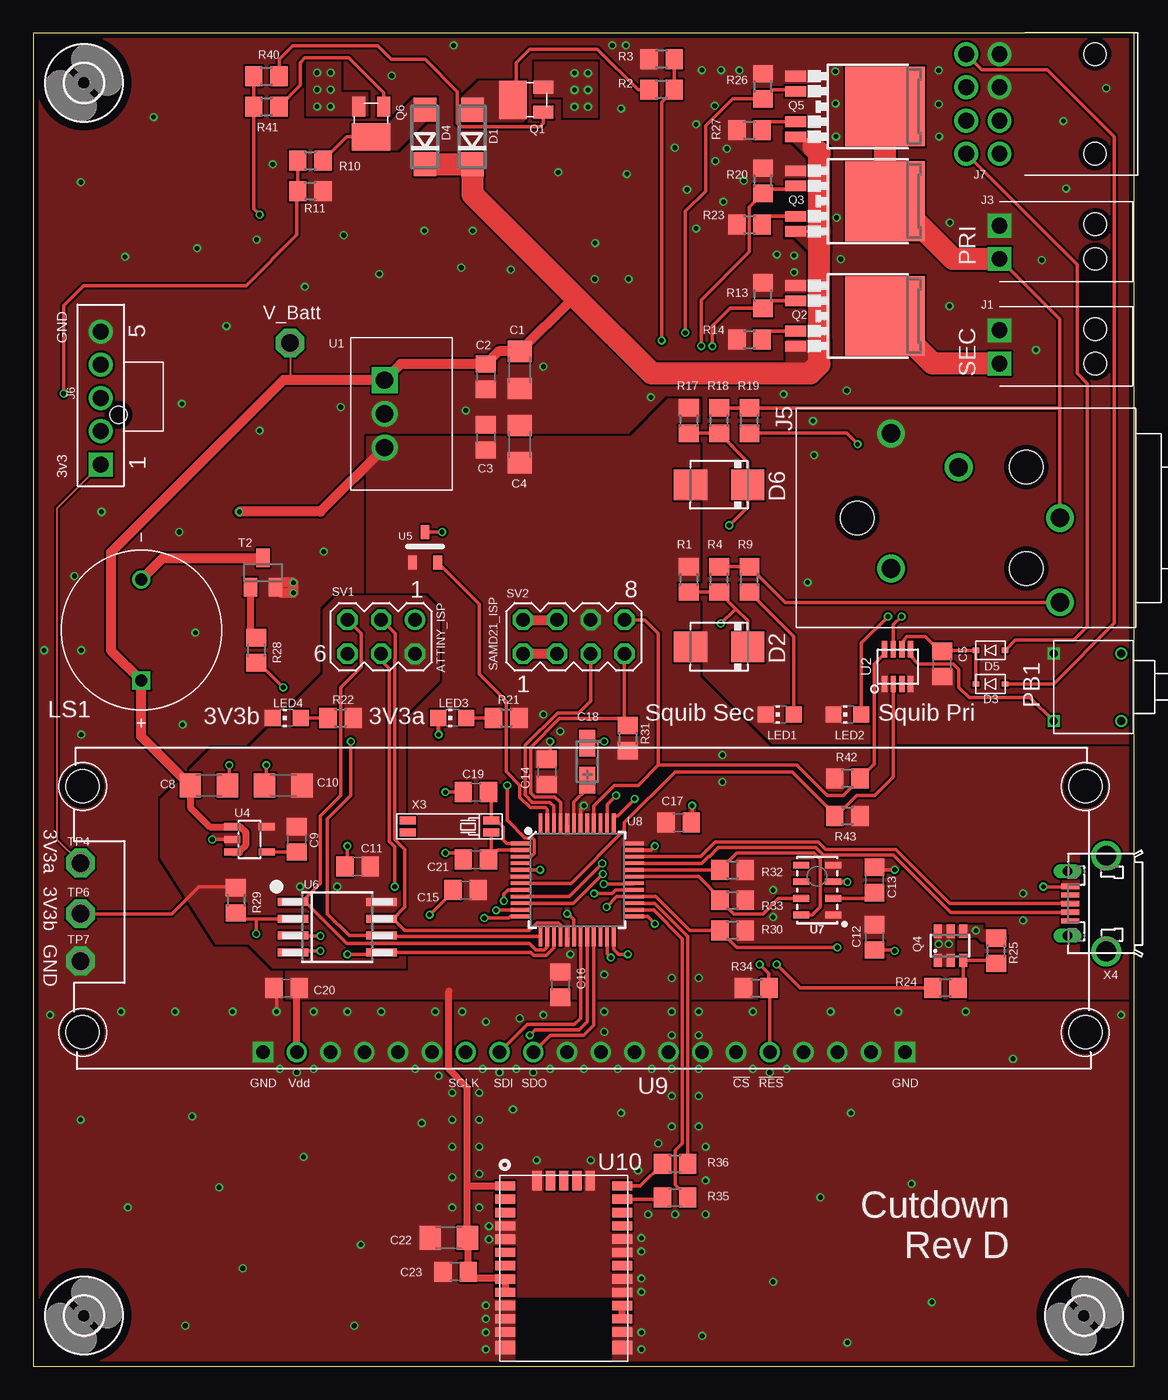
[diagram p5: board, top side]
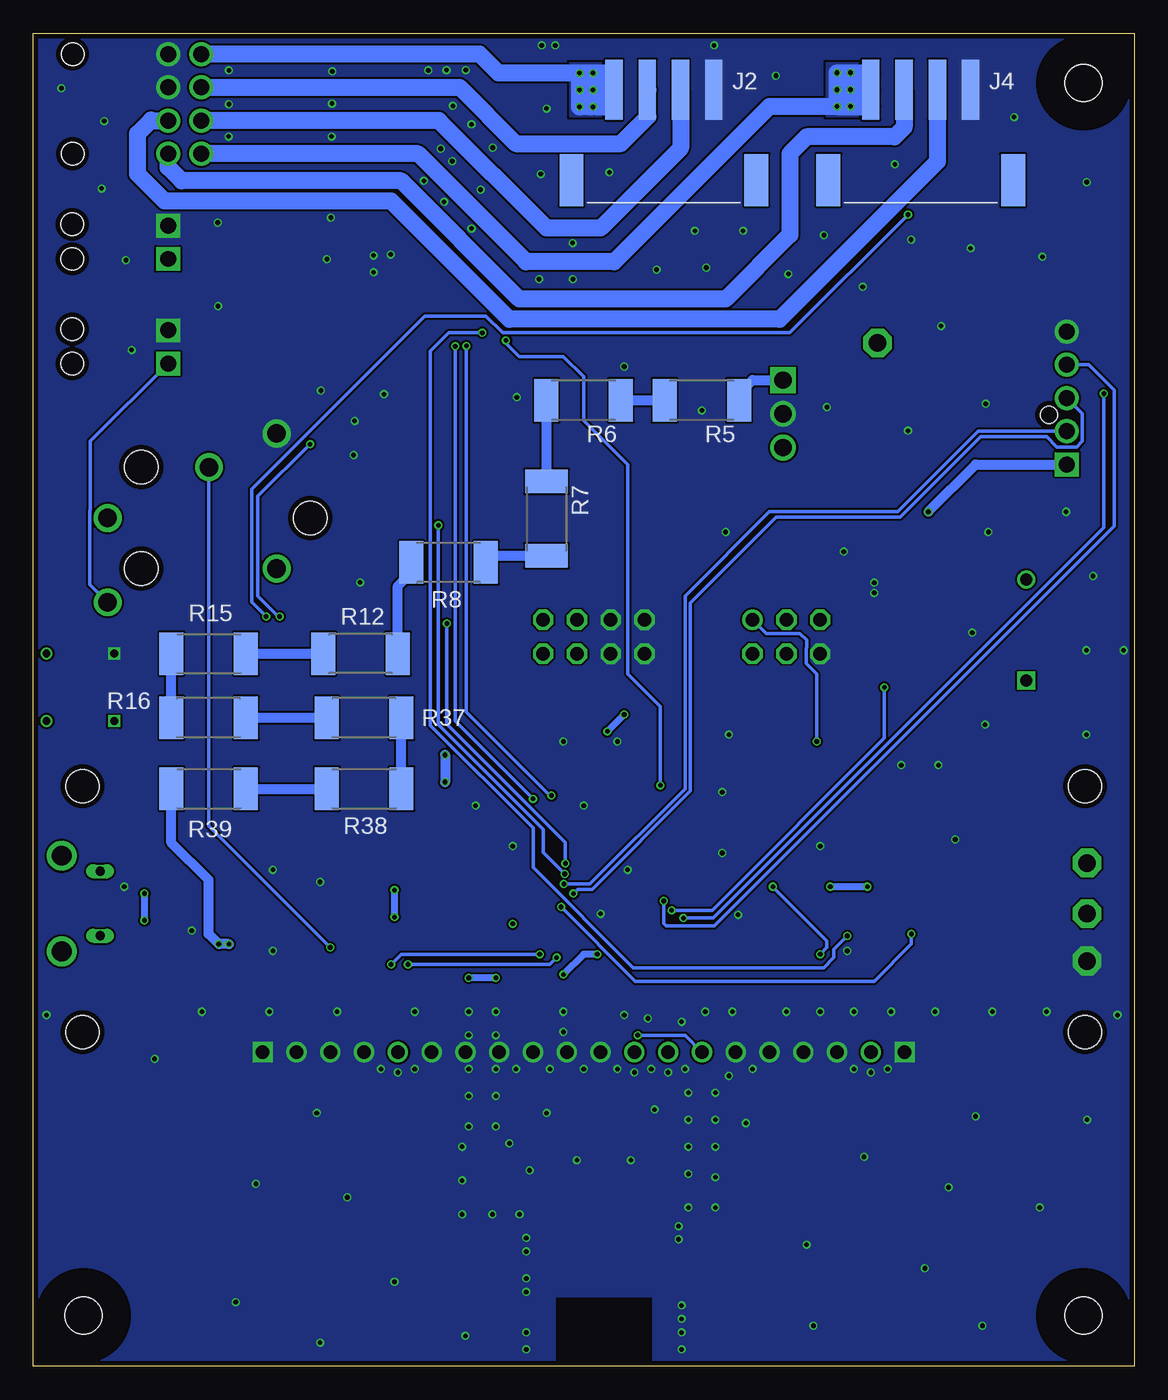
[diagram p6: board, bottom side, seen from below]

Size 82.78 x 100.25 mm. Coordinates in mm from the lower left corner, seen from the top.
Outline: 0,0 82.78,0 82.78,100.25 0,100.25 0,0
Copper layers (1*16): Top 0.035559375mm / dielectric 1.6mm / Bottom 0.035559375mm
Design rules "oshpark-2layer *": minimum track width 6mil, minimum drill 10mil, track to track 6mil, track to pad 6mil, pad to pad 6mil, via to via 6mil, smd to smd 6mil, copper to edge 15mil, drill to drill 6mil, minimum pad ring 5mil, minimum via ring 5mil, stop-mask expansion 2.5mil, vias tented up to drill 0mil, thermal gap 10mil

### Footprints (pad centres in the part's own frame; a part is rotated, then mirrored left to right if it is on the bottom)
C1206 = smd 1.6 x 1.8: 1 -1.4,0; 2 1.4,0
C0805 = smd 1.3 x 1.5: 1 -0.95,0; 2 0.95,0
CT3216 = smd 2 x 1.2: + -1.4,0; - 1.4,0
DO214AC = smd 1.8 x 1.7: A 2.05,0; C -2.05,0
DO214AA = smd 2.5 x 2.3: A 2.15,0; C -2.15,0
BAT54HT1G = smd 0.4 x 0.5: A 0,-2.2; C 0,0
DECTOR_PARTS_TR_NANOFIT_1X2_RIGHTANGLE = drill 1.2 square: P$1 -1.3,0; P$2 1.2,0 | hole 1.7: -1.3,-7.2; 1.3,-7.2
S4B-XH-SM4-TB = smd 1.3 x 4.5: 1 0,0; 2 2.5,0; 3 5,0; 4 7.5,0 | smd 1.8 x 3.9: S1 -3.2,-6.8; S2 10.7,-6.8
RN114BPC = drill 1.397: R 15.24,-6.35; RS 2.54,-3.81; S 15.24,0; T 2.54,6.35; TS 7.62,3.81 | hole 2.54: 0,0; 12.7,3.81; 12.7,-3.81
1053091305 = drill 1.2 square: 1 0,0 | drill 1.2: 2 2.5,0; 3 5,0; 4 7.5,0; 5 10,0 | hole 1.3: 3.747,-1.34
1053141208 = drill 1.2 pad 1.8: 1 7.5,2.5; 2 5,2.5; 3 2.5,2.5; 4 0,2.5; 5 7.5,0; 6 5,0; 7 2.5,0; 8 0,0 | hole 1.7: 0,-7.18; 7.5,-7.18
CHIP-LED0805 = smd 1.2 x 1.2: A 0,-1.05; C 0,1.05
CEM-1212C = drill 0.9 square: + -3.8,0 | drill 0.9: - 3.8,0
FP11SPA1B1TP03 = drill 0.6 square: 1 0,0; 3 5.08,0 | drill 0.6: 2 0,5.08; 4 5.08,5.08
SI1247DS = smd 2.896 x 2.057: D 0,0 | smd 0.991 x 1.499: G -0.94,-2.286; S 0.94,-2.286
PG-TO252-5-11 = smd 0.8 x 1.6: 1 -2.28,-5.41; 2 -1.14,-5.41; 4 1.14,-5.41; 5 2.28,-5.41 | smd 6 x 6: TAB 0,1.3
SC-95(TSMT6) = smd 0.6 x 1: 1 0.2,0.3; 2 1.15,0.3; 3 2.1,0.3; 4 2.1,2.5; 5 1.15,2.5; 6 0.2,2.5
R0805 = smd 1.3 x 1.5: 1 -0.95,0; 2 0.95,0
R2512 = smd 1.8 x 3.2: 1 -2.8,0; 2 2.8,0
MA03-2 = drill 1.016: 1 -2.54,-1.27 | drill 1.016 octagon: 2 -2.54,1.27; 3 0,-1.27; 4 0,1.27; 5 2.54,-1.27; 6 2.54,1.27
MA04-2 = drill 1.016 octagon: 1 -3.81,-1.27; 2 -3.81,1.27; 3 -1.27,-1.27; 4 -1.27,1.27; 5 1.27,-1.27; 6 1.27,1.27; 7 3.81,-1.27; 8 3.81,1.27
SOT23 = smd 1 x 1.4: 1 -0.95,-1.1; 2 0.95,-1.1; 3 0,1.1
P1-13 = drill 1.321 pad 2.159 octagon: TP 0,0
R-783P3-0P5_DC-DC = drill 1.3 square: 1 0,2.54 | drill 1.3: 2 0,0; 3 0,-2.54
LTC2955_TSOT-8 = smd 1.22 x 0.4: P$1 0,0; P$2 0,-0.65; P$3 0,-1.3; P$4 2.62,0; P$5 2.62,-0.65; P$6 2.62,-1.3; P$7 0,-1.95; P$8 2.62,-1.95
TSOT23-5 = smd 0.55 x 1.2: 1 -0.95,-1.3; 2 0,-1.3; 3 0.95,-1.3; 4 0.95,1.3; 5 -0.95,1.3
MCP9700T-E/TT = smd 0.65 x 1.05: P$1 -0.95,-2.3; P$2 0.95,-2.3; P$3 0,0
SOIC8_EIAJ_208MIL = smd 0.6 x 2.286: 1 -1.905,-3.33; 2 -0.635,-3.33; 3 0.635,-3.33; 4 1.905,-3.33; 5 1.905,3.33; 6 0.635,3.33; 7 -0.635,3.33; 8 -1.905,3.33
LGA-8-5X3 = smd 1.2 x 0.5: 1 -1.2,1.875; 2 -1.2,0.625; 3 -1.2,-0.625; 4 -1.2,-1.875; 5 1.2,-1.875; 6 1.2,-0.625; 7 1.2,0.625; 8 1.2,1.875
TQFP-48 = smd 1.5 x 0.28: 1 -4.25,2.75; 2 -4.25,2.25; 3 -4.25,1.75; 4 -4.25,1.25; 5 -4.25,0.75; 6 -4.25,0.25; 7 -4.25,-0.25; 8 -4.25,-0.75; 9 -4.25,-1.25; 10 -4.25,-1.75; 11 -4.25,-2.25; 12 -4.25,-2.75; 25 4.25,-2.75; 26 4.25,-2.25; 27 4.25,-1.75; 28 4.25,-1.25; 29 4.25,-0.75; 30 4.25,-0.25; 31 4.25,0.25; 32 4.25,0.75; 33 4.25,1.25; 34 4.25,1.75; 35 4.25,2.25; 36 4.25,2.75 | smd 0.28 x 1.5: 13 -2.75,-4.25; 14 -2.25,-4.25; 15 -1.75,-4.25; 16 -1.25,-4.25; 17 -0.75,-4.25; 18 -0.25,-4.25; 19 0.25,-4.25; 20 0.75,-4.25; 21 1.25,-4.25; 22 1.75,-4.25; 23 2.25,-4.25; 24 2.75,-4.25; 37 2.75,4.25; 38 2.25,4.25; 39 1.75,4.25; 40 1.25,4.25; 41 0.75,4.25; 42 0.25,4.25; 43 -0.25,4.25; 44 -0.75,4.25; 45 -1.25,4.25; 46 -1.75,4.25; 47 -2.25,4.25; 48 -2.75,4.25
NHD-0216CW-AW3 = drill 1.016 square: P$1 48.26,0; P$20 0,0 | drill 1.016: P$2 45.72,0; P$3 43.18,0; P$4 40.64,0; P$5 38.1,0; P$6 35.56,0; P$7 33.02,0; P$8 30.48,0; P$9 27.94,0; P$10 25.4,0; P$11 22.86,0; P$12 20.32,0; P$13 17.78,0; P$14 15.24,0; P$15 12.7,0; P$16 10.16,0; P$17 7.62,0; P$18 5.08,0; P$19 2.54,0 | hole 2.5: -13.564,-1.499; 61.824,-1.499; -13.564,-19.99; 61.824,-19.99
CAM_M8C = smd 0.7 x 1.5: 1 -6.2,-4.4; 2 -5.2,-4.4; 3 -4.2,-4.4; 4 -3.2,-4.4; 5 -2.2,-4.4; 6 -1.2,-4.4; 7 -0.2,-4.4; 8 0.8,-4.4; 9 1.8,-4.4; 10 2.8,-4.4; 11 3.8,-4.4; 12 4.8,-4.4; 15 4.8,4.4; 16 3.8,4.4; 17 2.8,4.4; 18 1.8,4.4; 19 0.8,4.4; 20 -0.2,4.4; 21 -1.2,4.4; 22 -2.2,4.4; 23 -3.2,4.4; 24 -4.2,4.4; 25 -5.2,4.4; 26 -6.2,4.4 | smd 1 x 1.5: 13 5.95,-4.4; 14 5.95,4.4 | smd 1.5 x 0.7: 27 -6.6,2; 28 -6.6,1; 29 -6.6,0; 30 -6.6,-1; 31 -6.6,-2
2,8 = hole 2.8: 0,0
MC-146 = smd 1.2 x 0.6: P$1 -3.2,-0.4; P$2 3.1,-0.4; P$3 3.1,0.5; P$4 -3.2,0.5
ZX62D-B-5PA8 = smd 1.35 x 0.4: 1 4.825,1.3; 2 4.825,0.65; 3 4.825,0; 4 4.825,-0.65; 5 4.825,-1.3 | drill 1.5: S1 2.15,-3.6; S2 2.15,3.6 | drill 0.7 long: S3 5.05,2.425; S4 5.05,-2.425

### Placement (x,y rotation side)
C1  36.58,74.93 270 top
C2  34.04,74.42 270 top
C3  34.04,69.85 90 top
C4  36.58,69.34 90 top
C5  68.33,52.83 270 top
C8  13.21,43.69 0 top
C9  19.81,39.62 270 top
C10  18.8,43.69 180 top
C11  24.38,37.59 180 top
C12  63.25,32.26 270 top
C13  63.25,36.58 90 top
C14  38.61,44.7 90 top
C15  32.51,35.81 180 top
C16  39.62,28.7 270 top
C17  48.51,40.89 0 top
C18  41.66,45.47 90 top
C19  33.27,43.18 0 top
C20  19.05,28.45 180 top
C21  33.27,38.1 0 top
C22  31.24,9.65 180 top
C23  31.75,7.11 180 top
D1  33.02,92.46 90 top
D2  51.56,54.1 180 top
D3  70.87,51.31 90 top
D4  29.46,92.46 90 top
D5  70.87,53.85 90 top
D6  51.56,66.29 180 top
J1  72.64,76.71 90 top
J2  39.12,96.01 0 bottom
J3  72.64,84.58 90 top
J4  19.81,96.01 0 bottom
J5  61.95,63.8 0 top
J6  5.08,67.82 90 top
J7  72.64,91.19 90 top
LED1  56.13,49.02 90 top
LED2  61.21,49.02 90 top
LED3  31.5,48.77 90 top
LED4  19.05,48.77 90 top
LS1  8.13,55.37 90 top
PB1  76.71,53.59 270 top
Q1  36.07,95.25 90 top
Q2  62.74,78.99 270 top
Q3  62.74,87.63 270 top
Q4  67.82,30.23 0 top
Q5  62.74,94.74 270 top
Q6  25.4,92.46 180 top
R1  49.28,59.18 270 top
R2  47.24,96.01 180 top
R3  47.24,98.3 180 top
R4  51.56,59.18 90 top
R5  32.51,72.64 180 bottom
R6  41.4,72.64 180 bottom
R7  44.2,63.75 270 bottom
R8  51.56,60.45 180 bottom
R9  53.85,59.18 90 top
R10  20.83,90.68 0 top
R11  20.83,88.39 0 top
R12  58.17,53.59 180 bottom
R13  54.86,80.52 90 top
R14  53.85,77.22 0 top
R15  69.6,53.59 0 bottom
R16  69.6,48.77 180 bottom
R17  49.28,71.12 270 top
R18  51.56,71.12 90 top
R19  53.85,71.12 90 top
R20  54.86,89.15 90 top
R21  35.56,48.77 0 top
R22  23.11,48.77 0 top
R23  53.85,85.85 0 top
R24  68.58,28.45 180 top
R25  72.39,31.24 90 top
R26  54.86,96.27 90 top
R27  53.85,92.96 0 top
R28  16.76,53.85 270 top
R29  15.24,35.05 270 top
R30  52.58,32.77 180 top
R31  44.7,47.24 270 top
R32  52.58,37.34 0 top
R33  52.58,35.05 0 top
R34  54.36,28.45 0 top
R35  48.26,12.7 0 top
R36  48.26,15.24 0 top
R37  57.91,48.77 180 bottom
R38  57.91,43.43 0 bottom
R39  69.6,43.43 0 bottom
R40  17.53,97.03 0 top
R41  17.53,94.74 0 top
R42  61.21,44.2 180 top
R43  61.21,41.4 0 top
SV1  26.16,54.86 180 top
SV2  40.64,54.86 0 top
T2  17.27,59.69 0 top
TP3  19.3,76.96 0 top
TP4  3.56,37.85 0 top
TP6  3.56,34.04 0 top
TP7  3.56,30.48 0 top
U1  26.42,71.63 0 top
U2  64.01,51.31 90 top
U4  16.26,39.62 270 top
U5  29.46,62.74 0 top
U6  22.86,33.02 270 top
U7  58.93,35.81 180 top
U8  40.89,36.58 0 top
U9  65.53,23.62 180 top
U10  39.88,7.37 270 top
U$16  [2,8]  3.81,3.81 0 top
U$17  [2,8]  78.99,3.81 0 top
U$18  [2,8]  3.81,96.52 0 top
X3  31.24,40.64 180 top
X4  82.8,34.8 180 top

### Tracks (layer width: path | path; a pad name or v marks a point on that pad's centre or on a via)
1.2V
  Top 0.254: U8.43 40.64,42.42 41.66,43.43 C18.+
!ATTINY_RST!
  Top 0.254: U8.14 38.63,32.31 38.63,31.52 38.41,31.3 37.79,31.3 37.28,31.81 23.57,31.81 20.45,34.92 U6.1 20.19,34.92 21.59,36.32 21.59,41.4 23.11,42.93 23.11,51.05 24.66,52.6 24.66,55.09 SV1.5
!BATT_EN  (via drill 0.35)
  Top 0.254: R40.1 R41.1 16.58,87.06 v17.02,86.61 | v65.28,56.39 64.66,55.77 U2.P$5
  Bottom 0.254: v17.02,86.61 25.91,77.72 47.5,77.72 48.77,78.99 53.34,78.99 66.37,65.96 66.37,57.48 v65.28,56.39
!OLED_RES!  (via drill 0.35)
  Top 0.254: U8.23 43.14,31.02 v43.43,30.73 | v54.61,30.23 55.31,29.53 R34.2 55.37,28.38 U9.P$16
  Bottom 0.254: v54.61,30.23 43.94,30.23 v43.43,30.73
!PWR_OFF!
  Top 0.254: U2.P$2 64.66,44.34 63.26,42.94 61.91,42.94 60.62,41.66 60.37,41.91 60.12,41.66 | R43.1 59.86,41.4 60.12,41.66 | U8.7 40.43,36.33 44.45,40.35 44.45,40.89 48.26,44.7 57.07,44.7 60.12,41.66
!SAMD21_RST!
  Top 0.254: U8.40 42.14,42.14 43.69,43.69 45.47,43.69 46.99,45.21 | 46.99,45.21 46.99,55.12 45.97,56.13 SV2.8 | U2.P$4 64.01,53.59 63.25,52.83 63.25,45.28 R42.1 60.89,42.93 59.69,42.93 57.4,45.21 46.99,45.21
!SYSTEM_ARM!  (via drill 0.35)
  Top 0.254: U6.2 16.76,33.66 | 16.76,33.66 15.69,33.66 R29.2 | v43.1,34.54 43.89,35.33 U8.28 46.78,35.33 49.34,32.77 R30.2 52.9,31.5 v60.45,31.5 | v16.76,32.51 16.76,33.66
  Bottom 0.254: v43.1,34.54 37.52,28.96 19.56,28.96 16.76,31.75 v16.76,32.51 | v60.45,31.5 69.6,40.64 69.6,67.59 J5.TS
ATTINY_MISO_DO  (via drill 0.35)
  Top 0.254: U8.13 26.25,32.33 U6.6 23.75,32.38 22.1,34.04 22.1,41.15 23.88,42.93 v23.88,46.99
  Bottom 0.254: v23.88,46.99 23.88,52.07 24.66,52.86 24.66,54.02 24.64,54.05 24.64,54.61 25.15,55.12 25.7,55.12 25.73,55.09 27.66,55.09 SV1.1
ATTINY_MOSI_DI  (via drill 0.35)
  Top 0.254: U8.15 39.14,31.45 38.58,30.89 37.62,30.89 37.4,31.11 U6.5 26.06,30.99 v23.62,30.99 | SV1.4 26.42,53.34 26.42,52.83 26.77,52.48 26.77,39.46 27.18,39.05 v27.18,36.07
  Bottom 0.254: v27.18,36.07 23.11,32 23.11,31.5 v23.62,30.99
ATTINY_SCK
  Top 0.254: U8.16 39.64,33.19 39.48,33.35 37.89,33.35 37.3,32.77 27.94,32.77 27.05,33.66 | U6.7 27.05,33.66 | 27.05,33.66 27.94,34.54 27.94,38.86 27.18,39.62 27.18,53.14 27.2,53.16 27.2,55.09 SV1.3
ATTINY_SQUIB_PRI  (via drill 0.35)
  Top 0.254: Q5.2 57.2,96.01 55.63,96.01 54.93,95.32 R26.1 52.58,95.32 50.55,93.28 50.55,88.39 49.02,86.87 v49.02,77.72 | v21.59,32.36 19.55,32.36 U6.3
  Bottom 0.254: v49.02,77.72 51.56,77.72 52.93,76.35 52.93,48.2 45.21,40.48 45.21,37.52 37.67,29.97 23.37,29.97 22.61,30.73 22.61,31.34 v21.59,32.36
BATTPRI
  Top 0.254: Q1.D 36.32,95.5 36.32,98.04 37.34,99.06 42.42,99.06 45.47,96.01 R2.2
  pour Top (no thermals): 32.23,93.65 36.83,93.65 37.01,93.83 37.01,96.62 33.5,96.62 32.23,95.35
BATTPRI_1S
  Bottom 1.27: J2.3 34.12,91.61 40.13,85.6 44.2,85.6 52.28,93.69 J7.3
BATTPRI_2S
  Bottom 1.27: J7.2 50.72,96.19 46.49,91.96 38.6,91.96 36.58,93.98 36.58,95.97 J2.2
BATTPRI_RAW  (via drill 0.35)
  Top 0.254: J7.1 71.32,97.51 76.23,97.51 81.28,92.46 81.28,55.88 76.71,51.31 D3.A
  Bottom 1.27: v41.71,97.26 41.68,97.28 39.12,97.28 | 40.41,94.72 39.14,94.72 | v41.71,95.99 41.68,96.01 J2.1 40.41,94.72 | 40.41,94.72 40.89,94.72 | 40.89,94.72 v41.71,94.72 v41.71,97.26 | v41.71,97.26 40.89,96.44 40.89,94.72 | v41.71,97.26 47.8,97.26 49.23,98.69 J7.1
  other vias: 40.69,95.99 40.69,97.26 40.69,94.72
  pour Bottom: 38.61,98.04 38.61,93.98 42.42,93.98 42.42,98.04
  pour Top (no thermals): 42.42,98.04 37.69,98.04 37.69,95.5 39.88,95.5 39.88,93.98 42.42,93.98
BATTPRI_VMON  (via drill 0.35)
  Top 0.254: v47.24,77.14 47.24,95.06 R2.1 R3.1 | v35.64,43.69 35.64,41.07 36.96,39.74 37.51,39.74 37.67,39.58 37.67,38.57 37.43,38.33 U8.3
  Bottom 0.254: v35.64,43.69 35.64,49.61 38.1,52.07 38.1,67.82 41.4,71.12 41.4,74.42 42.93,75.95 46.23,75.95 47.24,76.96 v47.24,77.14
BATTSEC
  Top 0.254: R10.2 23.56,92.46 Q6.D
  pour Top (no thermals): 24.05,93.4 26.7,93.4 28.65,95.35 30.28,95.35 30.28,94.44 27.35,91.51 26.82,91.49 24.03,91.49 24.03,93.37
BATTSEC_1S
  Bottom 1.27: J4.3 14.81,90.6 26.67,78.74 46.99,78.74 55.88,87.63 72.9,87.63 74.93,89.66 74.93,92.71 73.91,93.73 73.87,93.69 J7.7
BATTSEC_2S
  Bottom 1.27: J4.2 17.31,93.18 18.03,92.46 24.64,92.46 25.91,91.19 25.91,85.09 30.73,80.26 46.23,80.26 55.12,89.15 71.63,89.15 72.64,90.17 J7.8
BATTSEC_RAW  (via drill 0.35)
  Top 0.254: J7.4 78.49,82.84 78.49,74.68 79.25,73.91 79.25,55.63 78.23,54.61 73.83,54.61 D5.A
  Bottom 1.27: 19.81,97.28 v22.35,97.28 v22.35,94.74 | v22.35,94.74 19.81,94.74 | v22.35,96.01 J4.1 21.08,94.74 v22.35,94.74 | v22.35,94.74 27.43,94.74 39.12,83.06 45.72,83.06 53.85,91.19 J7.4
  other vias: 21.34,97.28 21.34,94.74 21.34,96.01
  pour Bottom: 19.3,98.04 19.3,93.98 23.11,93.98 23.11,98.04
  pour Top (no thermals): 23.11,98.04 20.57,98.04 20.57,94.08 25.15,94.08 25.15,95.76 23.11,95.76
BATTSEC_VMON  (via drill 0.35)
  Top 0.254: R10.1 R11.1 19.81,88.33 19.81,85.09 16,81.28 3.81,81.28 2.29,79.76 v2.29,73.15 | U8.12 35.86,33.83 35.74,33.71 v33.91,33.71
  Bottom 0.254: v33.91,33.71 31.67,33.71 2.29,63.09 v2.29,73.15
BUZZER  (via drill 0.35)
  Top 0.254: U8.11 34.83,34.33 v34.8,34.29 | v18.8,51.05 16.95,52.9 R28.2
  Bottom 0.254: v34.8,34.29 31.75,34.29 18.8,47.24 v18.8,51.05
GND  (via drill 0.35)
  Top 0.254: C10.2 17.53,43.82 v17.53,45.21 | C8.2 14.73,43.81 v14.73,45.21 | U4.2 v13.46,39.62 | v23.62,39.12 23.62,37.78 C11.2 | U6.4 19.66,31.24 v21.59,31.24 | v18.29,26.67 18.29,28.26 C20.2 | v38.1,37.34 36.66,37.34 U8.5 | v41.4,42.16 41.14,41.91 U8.42 | U8.35 46.45,38.83 v46.74,39.12 | v49.53,42.16 49.53,40.96 C17.2 | v42.93,46.99 41.78,46.99 C18.- | v38.86,46.99 38.86,45.91 C14.2 | v40.13,34.04 40.2,34.04 40.64,33.6 U8.18 | C21.1 31.82,38.61 v30.99,38.61 | C15.2 31.56,35.73 v29.79,33.96 | v30.99,43.18 C19.1 | v30.48,47.5 30.45,47.53 LED3.C | v64.77,37.34 63.43,37.34 C13.2 | v61.21,36.42 60.14,36.42 U7.3 | C12.2 64.7,31.31 v64.77,31.24 | X4.5 77.95,36.07 v75.95,36.07 | U5.P$3 v30.73,62.74
  Top 0.762: SV2.2 SV2.4 | SV2.1 SV2.3 | v19.56,58.93 18.56,58.93 T2.2 18.65,58.17 v19.56,58.17 v19.56,58.93
  other vias: 17.02,70.36 38.35,75.18 32.51,71.88 23.11,72.14 45.72,9.65 45.72,8.64 45.72,6.6 45.72,5.59 45.72,2.54 45.72,1.27 34.04,1.27 34.04,2.54 34.04,3.56 34.04,4.57 34.26,9.55 34.26,10.54 37.85,15.49 41.91,15.49 7.11,11.94 15.75,7.37 20.32,15.75 11.94,18.8 24.64,9.14 24.13,3.05 11.43,3.05 3.56,18.54 61.47,19.05 29.21,18.29 44.2,19.05 55.63,6.35 67.56,4.83 59.18,12.7 66.04,13.72 61.21,1.78 73.66,23.11 10.67,26.67 36.07,19.3 50.29,2.29 13.97,13.46 1.27,26.42 81.79,26.42 70.1,26.67 65.02,26.67 59.94,26.67 54.1,26.67 50.04,26.67 42.93,26.67 38.35,26.42 32.26,26.67 30.23,26.67 21.08,26.67 14.99,26.67 6.6,26.67 48.01,18.03 48.01,20.32 48.01,22.35 48.01,24.89 48.01,26.67 50.04,24.89 50.04,22.35 50.04,20.32 50.04,18.03 46.99,16.76 45.47,14.73 50.55,16.51 50.55,13.97 50.55,11.43 48.26,11.43 46.23,11.43 31.5,11.94 31.5,14.22 31.5,16.51 31.5,18.54 31.5,20.57 33.53,20.57 33.53,18.54 33.53,16.51 33.53,14.48 33.53,11.94 26.16,26.67 23.62,26.67 34.04,25.91 36.58,26.16 42.93,25.15 33.78,22.35 36.32,22.35 38.86,22.35 41.4,22.35 43.94,22.35 28.7,22.35 46.48,22.35 54.1,22.35 56.64,22.35 18.54,22.35 21.08,22.35 35.05,22.1 37.59,22.1 30.48,21.84 19.81,22.1 55.37,22.1 44.55,99.34 53.09,97.46 51.28,90.63 52.15,91.57 53.42,89.15 3.58,89.05 6.91,83.44 9.04,93.95 12.32,84.07 14.53,78.23 16.79,84.73 20.42,81.18 23.34,85.06 26.01,82.14 29.41,85.39 32.18,82.63 33.05,85.39 35.92,82.47 39.47,89.79 44.63,89.66 44.2,94.59 49.83,93.4 51.23,94.79 42.24,84.48 51.89,87.58 49.15,88.49 49.83,85.57 68.91,86 68.88,79.73 75.39,76.43 75.82,83.19 77.65,88.57 77.44,93.65 80.67,96.11 0.81,53.85 10.97,62.74 21.84,61.26 3.61,53.85 12.19,55.17 57.2,82.27 57.2,83.54 55.91,83.62 51.71,97.49 50.27,97.49 48.23,91.64 42.21,81.76 44.75,81.76 3.1,59.44 3.61,47.5 5.13,64.26 11.23,48.26 11.18,72.39 68.07,97.46 68.07,94.92 68.1,92.48 26.95,97.05 18.01,90.4 70.87,32.77 61.16,73.38 58.62,71.09 58.7,68.53 58.22,58.95 46.43,72.87 56.41,73.1 43.54,99.34 31.6,99.34 60.35,92.48 60.33,94.97 60.3,97.38 60.4,86.39 60.71,83.26
  pour Top (rank 6, no thermals): 0,100.33 82.8,100.33 82.8,0 0,0
  pour Bottom (rank 6, no thermals): 0,100.33 0,0 82.8,0 82.8,100.33
  pour Top: 69.67,33.17 70.87,33.17 71.32,33.17 71.68,32.82 73.1,32.82 73.1,31.62 71.68,31.62 70.99,32.31 69.7,32.31 69.67,32.31
GPS_RX
  Top 0.254: R36.2 49.21,32.32 46.71,34.83 U8.27
GPS_TX
  Top 0.254: U8.26 45.16,34.31 46.64,34.31 48.8,32.16 48.8,16.76 48.26,16.22 48.26,13.65 R35.2
HEATER_GATE  (via drill 0.35)
  Top 0.254: U8.24 43.64,31.35 44,30.99 v44.7,30.99 | v55.88,30.23 57.66,28.45 R24.2
  Bottom 0.254: v44.7,30.99 55.12,30.99 v55.88,30.23
N$2
  Top 0.508: T2.1 16.32,55.24 R28.1
N$3
  Bottom 0.762: R6.1 R5.2
N$4
  Top 0.254: R40.2 18.48,98.3 19.49,99.31 25.91,99.31 26.92,98.3 29.46,98.3 31.89,95.87 31.89,93.49 32.16,93.22 38.1,93.22 38.35,93.47 Q1.G
N$5
  Bottom 0.762: R7.1 R6.2
N$6
  Bottom 0.762: R8.1 48.26,60.95 R7.2
N$7
  Bottom 0.762: R12.1 55.37,58.68 54.36,59.68 R8.2
N$8
  Bottom 0.762: R15.2 R12.2
N$9
  Top 0.254: U7.2 62.81,35.19 C13.1
N$10
  Top 0.508: U10.16 U10.17
N$11
  Top 0.254: R35.1 47.28,12.67 47.18,12.57 U10.25
N$12
  Top 0.254: U8.2 34.95,38.83 34.44,38.32 | C21.2 34.26,38.13 34.44,38.32 | X3.P$4 34.44,38.32
N$13
  Top 0.254: LED3.A R21.1
N$14
  Top 0.254: R14.2 55.44,77.85 Q2.4
N$15
  Top 0.254: LED4.A R22.1
N$16
  Top 0.254: R9.1 57.18,54.9 LED1.A
N$17
  Bottom 0.762: R16.2 R15.1
N$18
  Bottom 0.762: R37.2 R16.1
N$19
  Top 0.254: R23.2 55.44,86.49 Q3.4
N$20
  Top 0.254: R27.2 55.44,93.6 Q5.4
N$21  (via drill 0.35)
  Top 0.254: R19.1 61.15,70.17 v61.98,69.34 | v64.26,56.39 62.26,54.39 LED2.A
  Bottom 0.254: v61.98,69.34 65.89,65.43 65.89,57.91 64.36,56.39 v64.26,56.39
N$22
  Bottom 0.762: R38.2 R37.1
N$23
  Top 0.254: R25.1 72.3,30.39 72.16,30.53 Q4.3 69.92,28.84 R24.1
N$24
  Top 0.254: U8.1 35.6,39.33 35.31,39.62 35.31,39.71 35.32,39.72 35.32,40.56 34.84,41.04 X3.P$1 34.44,42.96 C19.2
N$25
  Bottom 0.762: R39.2 R38.1
N$26
  Top 0.762: LS1.- 9.75,60.79 T2.3
N$27
  Top 0.254: U4.4 C9.2
N$28
  Top 0.254: R36.1 45.64,13.57 U10.26
N$29  (via drill 0.35)
  Bottom 0.762: v68.07,31.75 v68.83,31.75 69.6,32.51 69.6,36.58 72.4,39.38 R39.1
  pour Top (no thermals): 69.19,33.15 69.19,30.1 67.79,30.1 67.84,33.15
N$30
  Top 0.254: R41.2 20.07,96.33 20.07,98.04 20.42,98.4 23.71,98.4 26.34,95.77 Q6.G
N$32
  Top 0.254: PB1.3 74.93,50.29 70.36,50.29 69.6,51.05 69.6,52.41 69.17,52.83 66.55,52.83 65.96,53.42 U2.P$8
N$33
  Top 0.254: D3.C D5.C 68.39,53.85 C5.1 68.14,53.78 67.06,54.86 65.69,54.86 65.48,54.65 65.48,54.61 65.31,54.44 U2.P$6
OLED_MISO
  Top 0.254: U8.21 42.14,25.63 41.4,24.89 38.86,24.89 U9.P$9
OLED_MOSI
  Top 0.254: U8.19 41.14,26.16 40.69,25.7 37.13,25.7 U9.P$8
OLED_SCLK  (via drill 0.35)
  Top 0.254: U8.20 41.64,25.9 41.05,25.3 37.74,25.3 v37.34,24.89
  Bottom 0.254: v37.34,24.89 33.78,24.89 U9.P$7
PRESSURE_SCL
  Top 0.254: U8.32 45.16,37.34 R32.1 52.9,38.61 58.67,38.61 59.18,38.1 59.18,34.54 58.58,33.94 U7.8
PRESSURE_SDA
  Top 0.254: U8.31 50.04,36.83 51.63,35.24 R33.1 52.66,34.02 54.29,34.02 54.31,34.04 54.86,34.04 56.02,35.19 U7.7
RADIO_RX  (via drill 0.35)
  Top 0.254: U8.29 43.81,35.82 43.54,35.55 v42.17,35.55
  Bottom 0.254: v42.17,35.55 41.86,35.87 40.77,35.87 33.38,43.27 33.38,57.4 26.92,63.86 17.61,63.86 11.56,69.91 6.6,69.91 5.82,69.14 4.34,69.14 3.9,69.58 3.9,71.64 J6.3
RADIO_TX  (via drill 0.35)
  Top 0.254: U8.30 45.09,36.27 v42.89,36.27
  Bottom 0.254: v42.89,36.27 40.94,36.27 33.78,43.43 33.78,57.91 27.43,64.26 17.78,64.26 11.72,70.32 J6.2
SAMD21_SQUIB_BCKP  (via drill 0.35)
  Top 0.254: Q2.2 55.43,80.13 R13.1 52.39,79.57 51.05,78.23 v51.05,76.71 | v45.21,42.67 43.94,41.4 43.64,41.4 U8.37
  Bottom 0.254: v51.05,76.71 51.05,48.51 v45.21,42.67
SAMD21_SQUIB_PRI  (via drill 0.35)
  Top 0.254: Q3.2 57.07,88.52 55.18,88.52 R20.1 53.85,87.19 53.85,83.82 50.22,80.19 v50.22,76.73 | U8.38 43.14,42.24 v43.83,42.93
  Bottom 0.254: v50.22,76.73 50.22,49.2 43.94,42.93 v43.83,42.93
SAMD21_SWCLK
  Top 0.254: SV2.7 44.45,48.45 R31.1 44.2,48.7 39.56,48.7 37.4,46.55 37.4,43.12 37.69,42.82 39.22,42.82 39.64,42.4 U8.45
SAMD21_SWDIO
  Top 0.254: U8.46 39.14,42.12 38.85,42.42 37.52,42.42 36.99,42.95 36.99,46.71 39.41,49.13 41.01,49.13 41.91,50.04 SV2.5
SPARE_GPIO1  (via drill 0.35)
  Top 0.254: U8.8 35.7,35.83 35.38,35.51 v35.38,35
  Bottom 0.254: v35.38,35 35.38,33.29 35.19,33.1 31.6,33.1 1.52,63.18 1.52,73.41 3.44,75.32 J6.4
SPARE_GPIO2  (via drill 0.35)
  Top 0.254: U8.25 46.18,33.83 v46.74,33.27
SQUIB_BCKP
  Top 0.254: J5.R 56.52,57.45 R9.2 R4.2
  Top 1.651: J1.P$1 67.62,75.41 Q2.TAB
  Bottom 0.254: J5.R 78.52,58.78 78.52,64.36 78.49,64.39 78.49,69.57 J1.P$1
SQUIB_BCKP_VMON  (via drill 0.35)
  Top 0.254: R1.2 R4.1 52.87,56.93 | 52.87,56.93 53.71,56.08 D2.C | U8.9 40.28,35.33 v42.77,37.82 | v51.69,55.85 52.76,56.93 52.87,56.93
  Bottom 0.254: v42.77,37.82 42.77,39.4 51.69,48.32 v51.69,55.85
SQUIB_PRI
  Top 0.254: J5.S 77.19,72.14 | 77.19,72.14 77.19,78.73 J3.P$1 | 77.19,72.14 77.12,72.07 54.1,72.07 R19.2 R18.2
  Top 1.651: J3.P$1 69.15,83.28 64.8,87.63 Q3.TAB Q5.TAB
SQUIB_PRI_VMON  (via drill 0.35)
  Top 0.254: R17.2 R18.1 53.71,68.02 D6.C 53.71,64.63 v52.32,63.25 | U8.10 40.62,34.82 v42.82,37.03
  Bottom 0.254: v42.82,37.03 44.45,38.66 44.45,40.39 52.32,48.26 v52.32,63.25
THERMISTOR_VOUT
  Top 0.254: U8.47 38.64,41.87 38.51,42.01 37.36,42.01 36.59,42.78 36.59,43.69 35.56,44.72 35.56,50.04 33.53,52.07 33.53,57.32 U5.P$2
USB_D+
  Top 0.254: X4.3 68.9,34.8 64.84,38.86 59.57,38.86 59.01,39.42 51.29,39.42 50.2,38.33 U8.34
USB_D-
  Top 0.254: U8.33 50.27,37.83 50.8,38.35 50.85,38.35 51.51,39.01 58.84,39.01 59.4,38.45 64.67,38.45 68.98,34.15 X4.2
V_BATT
  Top 0.152: TP3.TP 19.3,74.17 | Q3.5 59.1,85.35 59.11,85.34
  Top 0.508: C8.1 11.81,42.04 13.27,40.57 U4.1 15.56,40.57 16,40.13 15.96,40.09 15.96,39.18 15.49,38.71 15.49,38.61 15.02,38.61 U4.3
  Top 0.762: 40.89,80.26 40.51,80.26 C1.1 34.99,76.33 C2.1 27.62,75.37 U1.1 19.3,74.17 18.8,74.17 5.84,61.21 5.84,53.85 8.12,51.57 | 8.12,51.57 LS1.+ | C8.1 8.12,47.38 8.12,51.57
  Top 1.651: D4.C D1.C 33.02,88.14 40.89,80.26 46.48,74.68 58.42,74.68 59.11,75.36 59.11,85.34 59.11,91.26 58.67,91.69
  Bottom 0.762: R5.1 29.71,73.16 28.7,74.17 U1.1
  pour Top (no thermals): 56.57,92.81 58.57,92.81 59.87,91.52 59.87,90.93 58.32,90.93 57.15,92.1 56.59,92.1 56.57,92.13
  pour Top (no thermals): 56.59,85.7 56.59,84.99 57.25,84.99 58.32,83.92 59.87,83.92 59.87,85.7
  pour Top (no thermals): 56.62,77.04 56.62,73.94 58.55,73.94 58.57,73.96 59.87,75.26 59.87,75.51 59.87,77.09 56.62,77.09
VCC_1  (via drill 0.35)
  Top 0.152: J6.1 1.78,64.52 1.78,39.62 TP4.TP
  Top 0.508: C20.1 19.81,28.26 U9.P$2 | 32.64,13.72 C22.1 32.7,9.59 C23.1 32.7,6.67 32.77,6.6 35.44,6.6 U10.8 U10.9 | 32.64,13.72 32.64,20.95 31.24,22.35 31.24,28.19 | 32.64,13.72 32.79,13.57 U10.1
  Top 0.762: U1.3 21.59,64.26 v15.49,64.26
  Bottom 0.508: v38.35,49.02 v39.62,47.75 | v55.63,35.81 v55.63,33.78 | v40.39,30.99 41.4,30.99 v42.93,29.46 | v48.01,29.21 v50.04,29.21 | v74.42,35.56 v74.42,33.53
  Bottom 0.762: v51.82,45.97 v51.82,43.94 | v15.49,64.26 11.94,67.82 J6.1
  pour Top (rank 2, no thermals): 19.05,27.69 82.8,27.69 82.8,46.48 55.37,46.48 50.04,51.82 50.04,72.64 47.75,72.64 44.96,69.85 25.15,69.85 25.15,29.97 19.05,29.97
VCC_2  (via drill 0.35)
  Top 0.254: TP6.TP 10.41,34.04 12.45,36.07 15.17,36.07 R29.1
  Bottom 0.508: v20.07,36.07 v22.86,36.07
  pour Top (no thermals): 22.86,57.91 29.46,57.91 30.48,56.9 30.48,51.56 27.94,49.02 27.94,29.97 18.03,29.97 16.26,31.75 13.81,31.75 9.62,38.26 9.62,42.64 13.46,46.48 16.26,46.48 21.84,52.07 21.84,56.9

### Text on the board
tPlace: PRI | V_Batt | GND | SEC | 3v3 | 3V3b | 3V3a | Squib Sec | Squib Pri | 3V3a | 3V3b | GND | Cutdown / Rev D